# EAGLE design Goldilocks (EAGLE 6.3)
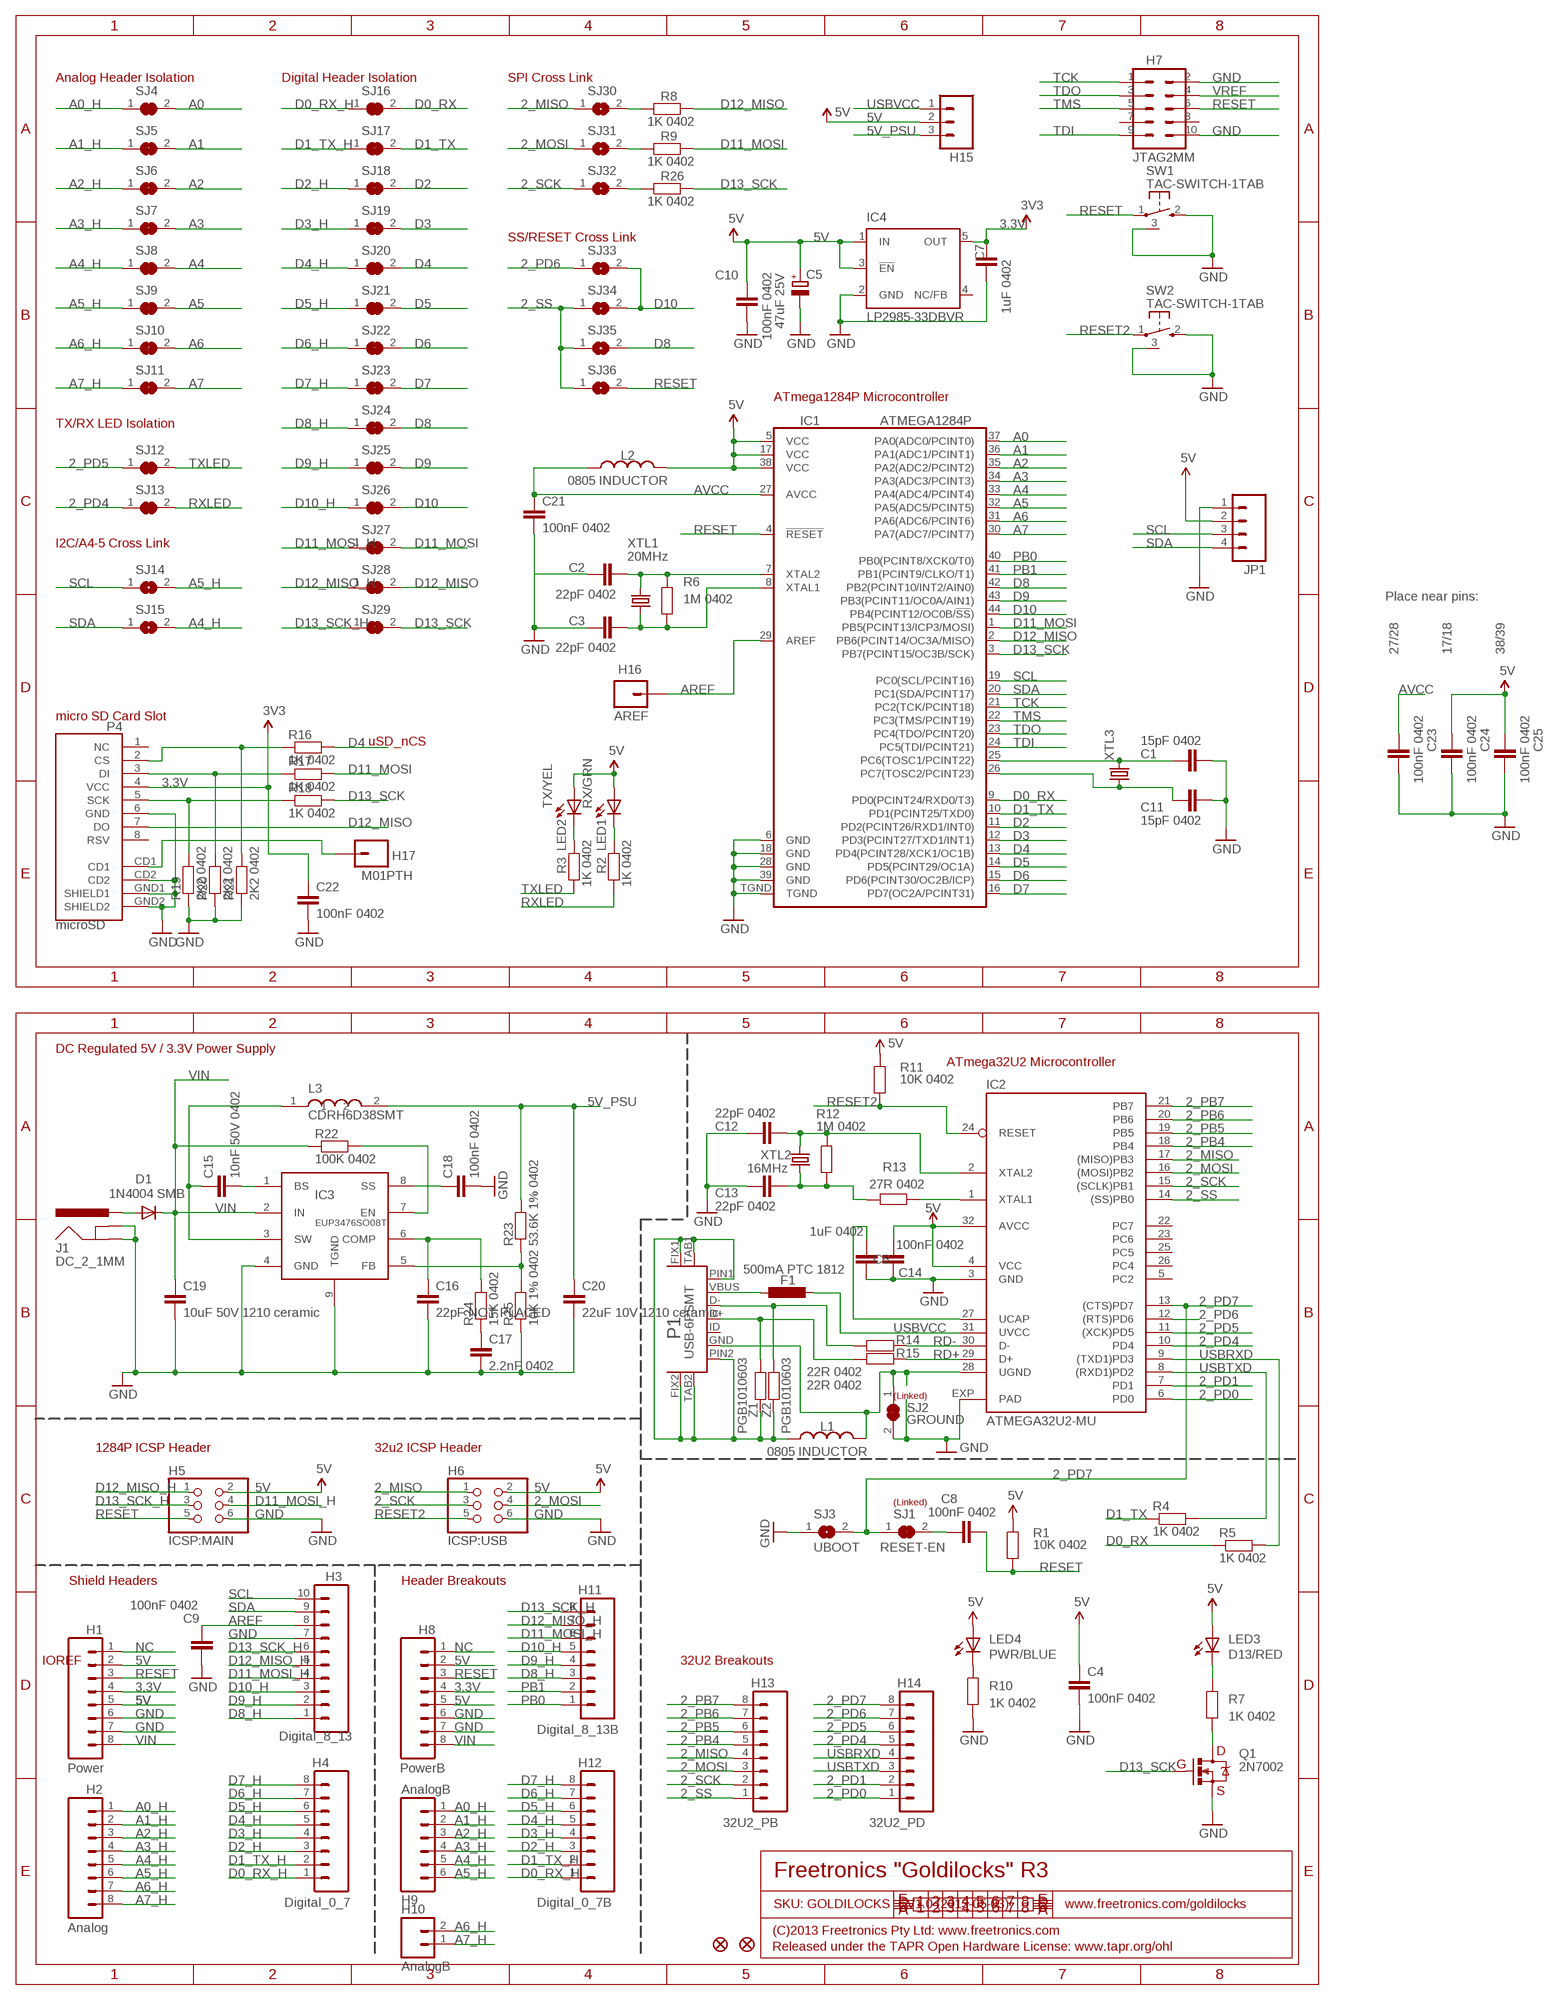
[diagram p0: schematic, sheet 1]

## Parts
C1  15pF 0402  C-EU0402C  [0402C]
C2  22pF 0402  C-EU0402C  [0402C]
C3  22pF 0402  C-EU0402C  [0402C]
C4  100nF 0402  C-EU0402C  [0402C]
C5  47uF 25V  CPOL-EUD  [PANASONIC_D]
C6  1uF 0402  C-EU0402C  [0402C]
C7  1uF 0402  C-EU0402C  [0402C]
C8  100nF 0402  C-EU0402C  [0402C]
C9  100nF 0402  C-EU0402C  [0402C]
C10  100nF 0402  C-EU0402C  [0402C]
C11  15pF 0402  C-EU0402C  [0402C]
C12  22pF 0402  C-EU0402C  [0402C]
C13  22pF 0402  C-EU0402C  [0402C]
C14  100nF 0402  C-EU0402C  [0402C]
C15  10nF 50V 0402  C-EU0402C  [0402C]
C16  22pF NOT PLACED  C-EU0402C  [0402C]
C17  2.2nF 0402  C-EU0402C  [0402C]
C18  100nF 0402  C-EU0402C  [0402C]
C19  10uF 50V 1210 ceramic  C-EUC1210  [C1210]
C20  22uF 10V 1210 ceramic  C-EUC1210  [C1210]
C21  100nF 0402  C-EU0402C  [0402C]
C22  100nF 0402  C-EU0402C  [0402C]
C23  100nF 0402  C-EU0402C  [0402C]
C24  100nF 0402  C-EU0402C  [0402C]
C25  100nF 0402  C-EU0402C  [0402C]
D1  1N4004 SMB  DIODESMB  [SMB-DIODE]
F1  500mA PTC 1812  L-EUL1812  [L1812]
H1  Power  M08  [1X08]
H2  Analog  M08  [1X08]
H3  Digital_8_13  M100.1  [1X10]
H4  Digital_0_7  M08  [1X08]
H5  ICSP:MAIN  PINHD-2X3  [2X03]
H6  ICSP:USB  PINHD-2X3  [2X03]
H7  JTAG2MM  [SAMTEC-TMM-DOUBLE]
H8  PowerB  M08  [1X08]
H9  AnalogB  M06SIP  [1X06]
H10  AnalogB  M02PTH  [1X02]
H11  Digital_8_13B  M08  [1X08]
H12  Digital_0_7B  M08  [1X08]
H13  32U2_PB  M08  [1X08]
H14  32U2_PD  M08  [1X08]
H15  M03PTH  [1X03]
H16  AREF  M01PTH  [1X01]
H17  M01PTH  [1X01]
IC1  ATMEGA1284P  [QFN-44M1]
IC2  ATMEGA32U2-MU  ATMEL_ATMEGA8U2-MUQFN  [ATMEL_QFN32]
IC3  EUP3476SO08T  [SO08T]
IC4  LP2985-33DBVR  TEXAS_TPS77033  [TEXAS_SOT23-DBV]
J1  DC_2_1MM  POWER_JACKPTH  [POWER_JACK_PTH]
JP1  M04PTH  [1X04]
L1  0805 INDUCTOR  INDUCTOR0805-LARGE  [0805-LARGE]
L2  0805 INDUCTOR  INDUCTOR0805-LARGE  [0805-LARGE]
L3  CDRH6D38SMT  [CDRH]
LED1  RX/GRN  LED0402  [LED-0402]
LED2  TX/YEL  LED0402  [LED-0402]
LED3  D13/RED  LED0402  [LED-0402]
LED4  PWR/BLUE  LED0402  [LED-0402]
P1  USB-6PSMT  [USB-MICROB-MB05PMXX]
P4  microSD  USD-SOCKETNEW  [MICRO-SD-SOCKET-PP]
Q1  2N7002  MOSFET-NCHANNELSMD  [SOT23-3]
R1  10K 0402  RESISTOR0402  [0402]
R2  1K 0402  RESISTOR0402  [0402]
R3  1K 0402  RESISTOR0402  [0402]
R4  1K 0402  RESISTOR0402  [0402]
R5  1K 0402  RESISTOR0402  [0402]
R6  1M 0402  RESISTOR0402  [0402]
R7  1K 0402  RESISTOR0402  [0402]
R8  1K 0402  RESISTOR0402  [0402]
R9  1K 0402  RESISTOR0402  [0402]
R10  1K 0402  RESISTOR0402  [0402]
R11  10K 0402  RESISTOR0402  [0402]
R12  1M 0402  RESISTOR0402  [0402]
R13  27R 0402  RESISTOR0402  [0402]
R14  22R 0402  RESISTOR0402  [0402]
R15  22R 0402  RESISTOR0402  [0402]
R16  1K 0402  RESISTOR0402  [0402]
R17  1K 0402  RESISTOR0402  [0402]
R18  1K 0402  RESISTOR0402  [0402]
R19  2K2 0402  RESISTOR0402  [0402]
R20  2K2 0402  RESISTOR0402  [0402]
R21  2K2 0402  RESISTOR0402  [0402]
R22  100K 0402  RESISTOR0402  [0402]
R23  53.6K 1% 0402  RESISTOR0402  [0402]
R24  15K 0402  RESISTOR0402  [0402]
R25  10K 1% 0402  RESISTOR0402  [0402]
R26  1K 0402  RESISTOR0402  [0402]
SJ1  RESET-EN  SJCN  [SJC]
SJ2  GROUND  SJCN  [SJC]
SJ3  UBOOT  SJ  [SJ]
SJ4  SJC0402  [0402SJC]
SJ5  SJC0402  [0402SJC]
SJ6  SJC0402  [0402SJC]
SJ7  SJC0402  [0402SJC]
SJ8  SJC0402  [0402SJC]
SJ9  SJC0402  [0402SJC]
SJ10  SJC0402  [0402SJC]
SJ11  SJC0402  [0402SJC]
SJ12  SJC0402  [0402SJC]
SJ13  SJC0402  [0402SJC]
SJ14  SJ  [SJ]
SJ15  SJ  [SJ]
SJ16  SJC0402  [0402SJC]
SJ17  SJC0402  [0402SJC]
SJ18  SJC0402  [0402SJC]
SJ19  SJC0402  [0402SJC]
SJ20  SJC0402  [0402SJC]
SJ21  SJC0402  [0402SJC]
SJ22  SJC0402  [0402SJC]
SJ23  SJC0402  [0402SJC]
SJ24  SJC0402  [0402SJC]
SJ25  SJC0402  [0402SJC]
SJ26  SJC0402  [0402SJC]
SJ27  SJC0402  [0402SJC]
SJ28  SJC0402  [0402SJC]
SJ29  SJC0402  [0402SJC]
SJ30  MISO  SJN  [SJ]
SJ31  MOSI  SJN  [SJ]
SJ32  SCK  SJN  [SJ]
SJ33  SJN  [SJ]
SJ34  SJN  [SJ]
SJ35  SJN  [SJ]
SJ36  SJN  [SJ]
SW1  TAC-SWITCH-1TAB  [TACT-VERT-1TAB]
SW2  TAC-SWITCH-1TAB  [TACT-VERT-1TAB]
U$5  FIDUCIAL1X2.5  [FIDUCIAL-1X2.5]
U$14  FIDUCIAL1X2.5  [FIDUCIAL-1X2.5]
XTL1  20MHz  CRYSTALHC49UV  [HC49U-V]
XTL2  16MHz  CRYSTALHC49UV  [HC49U-V]
XTL3  CRYSTALTC38H  [TC38H]
Z1  PGB1010603  RESISTOR0603  [0603]
Z2  PGB1010603  RESISTOR0603  [0603]

## Nets
2_MISO: H6.1 H13.4 IC2.17((MISO)PB3) SJ30.1
2_MOSI: H6.4 H13.3 IC2.16((MOSI)PB2) SJ31.1
2_PB4: H13.5 IC2.18(PB4)
2_PB5: H13.6 IC2.19(PB5)
2_PB6: H13.7 IC2.20(PB6)
2_PB7: H13.8 IC2.21(PB7)
2_PD0: H14.1 IC2.6(PD0)
2_PD1: H14.2 IC2.7(PD1)
2_PD4: H14.5 IC2.10(PD4) SJ13.1
2_PD5: H14.6 IC2.11((XCK)PD5) SJ12.1
2_PD6: H14.7 IC2.12((RTS)PD6) SJ33.1
2_PD7: H14.8 IC2.13((CTS)PD7) SJ1.1 SJ3.2
2_SCK: H6.3 H13.2 IC2.15((SCLK)PB1) SJ32.1
2_SS: H13.1 IC2.14((SS)PB0) SJ34.1 SJ35.1 SJ36.1
3.3V: C7.2 C22.1 H1.4 H8.4 IC4.5(OUT) P4.4(VCC) ; supply symbol labelled 3V3
5V: C4.1 C5.+ C10.1 C14.1 C24.1 C25.1 H1.2 H1.5 H5.2 H6.2 H8.2 H8.5 H15.2 IC1.5(VCC) IC1.17(VCC) IC1.38(VCC) IC2.4(VCC) IC2.32(AVCC) IC4.1(IN) IC4.3(!EN) JP1.2 L2.2 LED1.A LED2.A LED3.A LED4.A R1.2 R11.2
5V_PSU: C20.1 H15.3 L3.2 R23.2
A0: IC1.37(PA0(ADC0/PCINT0)) SJ4.2
A0_H: H2.1 H9.1 SJ4.1
A1: IC1.36(PA1(ADC1/PCINT1)) SJ5.2
A1_H: H2.2 H9.2 SJ5.1
A2: IC1.35(PA2(ADC2/PCINT2)) SJ6.2
A2_H: H2.3 H9.3 SJ6.1
A3: IC1.34(PA3(ADC3/PCINT3)) SJ7.2
A3_H: H2.4 H9.4 SJ7.1
A4: IC1.33(PA4(ADC4/PCINT4)) SJ8.2
A4_H: H2.5 H9.5 SJ8.1 SJ15.2
A5: IC1.32(PA5(ADC5/PCINT5)) SJ9.2
A5_H: H2.6 H9.6 SJ9.1 SJ14.2
A6: IC1.31(PA6(ADC6/PCINT6)) SJ10.2
A6_H: H2.7 H10.2 SJ10.1
A7: IC1.30(PA7(ADC7/PCINT7)) SJ11.2
A7_H: H2.8 H10.1 SJ11.1
AREF: C9.1 H3.8 H16.1 IC1.29(AREF)
AVCC: C21.1 C23.1 IC1.27(AVCC) L2.1
D0_RX: IC1.9(PD0(PCINT24/RXD0/T3)) R5.1 SJ16.2
D0_RX_H: H4.1 H12.1 SJ16.1
D1_TX: IC1.10(PD1(PCINT25/TXD0)) R4.1 SJ17.2
D1_TX_H: H4.2 H12.2 SJ17.1
D2: IC1.11(PD2(PCINT26/RXD1/INT0)) SJ18.2
D2_H: H4.3 H12.3 SJ18.1
D3: IC1.12(PD3(PCINT27/TXD1/INT1)) SJ19.2
D3_H: H4.4 H12.4 SJ19.1
D4: IC1.13(PD4(PCINT28/XCK1/OC1B)) R16.2 SJ20.2
D4_H: H4.5 H12.5 SJ20.1
D5: IC1.14(PD5(PCINT29/OC1A)) SJ21.2
D5_H: H4.6 H12.6 SJ21.1
D6: IC1.15(PD6(PCINT30/OC2B/ICP)) SJ22.2
D6_H: H4.7 H12.7 SJ22.1
D7: IC1.16(PD7(OC2A/PCINT31)) SJ23.2
D7_H: H4.8 H12.8 SJ23.1
D8: IC1.42(PB2(PCINT10/INT2/AIN0)) SJ24.2 SJ35.2
D8_H: H3.1 H11.3 SJ24.1
D9: IC1.43(PB3(PCINT11/OC0A/AIN1)) SJ25.2
D9_H: H3.2 H11.4 SJ25.1
D10: IC1.44(PB4(PCINT12/OC0B/!SS!)) SJ26.2 SJ33.2 SJ34.2
D10_H: H3.3 H11.5 SJ26.1
D11_MOSI: H5.4 IC1.1(PB5(PCINT13/ICP3/MOSI)) R9.2 R17.2 SJ27.2
D11_MOSI_H: H3.4 H11.6 SJ27.1
D12_MISO: H5.1 IC1.2(PB6(PCINT14/OC3A/MISO)) P4.7(DO) R8.2 SJ28.2
D12_MISO_H: H3.5 H11.7 SJ28.1
D13_SCK: H5.3 IC1.3(PB7(PCINT15/OC3B/SCK)) Q1.1(G) R18.2 R26.2 SJ29.2
D13_SCK_H: H3.6 H11.8 SJ29.1
GND: C1.2 C2.1 C3.1 C4.2 C5.- C6.2 C7.1 C9.2 C10.2 C11.2 C12.1 C13.1 C14.2 C16.2 C17.2 C18.2 C19.2 C20.2 C21.2 C22.2 C23.2 C24.2 C25.2 H1.6 H1.7 H3.7 H5.6 H6.6 H7.2 H7.10 H8.6 H8.7 IC1.6(GND) IC1.18(GND) IC1.28(GND) IC1.39(GND) IC1.TGND IC2.3(GND) IC2.EXP(PAD) IC3.4(GND) IC3.9(TGND) IC4.2(GND) J1.GND J1.GNDBREAK JP1.1 P4.6(GND) P4.CD2 P4.GND1(SHIELD1) P4.GND2(SHIELD2) Q1.2(S) R10.1 R19.1 R20.1 R21.1 R25.1 SJ2.2 SJ3.1 SW1.2 SW1.3 SW2.2 SW2.3
N$1: C8.1 SJ1.2
N$2: IC2.1(XTAL1) R13.1
N$3: L1.1 P1.FIX1 P1.FIX2 P1.PIN1 P1.PIN2 P1.TAB1 P1.TAB2 Z1.2 Z2.2
N$4: LED3.C R7.2
N$5: C2.2 IC1.7(XTAL2) R6.2 XTL1.2
N$6: Q1.3(D) R7.1
N$7: C3.2 IC1.8(XTAL1) R6.1 XTL1.1
N$8: D1.A J1.PWR
N$9: R8.1 SJ30.2
N$11: LED1.C R2.2
N$13: LED2.C R3.2
N$14: LED4.C R10.2
N$16: P1.D+ R15.2 Z1.1
N$17: P1.D- R14.2 Z2.1
N$19: C1.1 IC1.25(PC6(TOSC1/PCINT22)) XTL3.2
N$22: C11.1 IC1.26(PC7(TOSC2/PCINT23)) XTL3.1
N$23: C15.2 IC3.1(BS)
N$24: R9.1 SJ31.2
N$25: C15.1 IC3.3(SW) L3.1
N$28: C17.1 R24.1
N$31: IC3.5(FB) R23.1 R25.2
N$34: C18.1 IC3.8(SS)
N$36: R26.1 SJ32.2
N$37: IC3.7(EN) R22.2
N$43: C16.1 IC3.6(COMP) R24.2
N$113: C12.2 IC2.2(XTAL2) R12.2 XTL2.2
N$114: C13.2 R12.1 R13.2 XTL2.1
N$115: F1.1 P1.VBUS
N$117: C6.1 IC2.27(UCAP)
N$118: P4.2(CS) R16.1 R21.2
N$119: P4.3(DI) R17.1 R20.2
N$120: P4.5(SCK) R18.1 R19.2
N$121: H17.1 P4.CD1
NC: H1.1 H8.1
PB0: H11.1 IC1.40(PB0(PCINT8/XCK0/T0))
PB1: H11.2 IC1.41(PB1(PCINT9/CLKO/T1))
RD+: IC2.29(D+) R15.1
RD-: IC2.30(D-) R14.1
RESET: C8.2 H1.3 H5.5 H7.6 H8.3 IC1.4(!RESET) R1.1 SJ36.2 SW1.1
RESET2: H6.5 IC2.24(RESET) R11.1 SW2.1
RXLED: R2.1 SJ13.2
SCL: H3.10 IC1.19(PC0(SCL/PCINT16)) JP1.3 SJ14.1
SDA: H3.9 IC1.20(PC1(SDA/PCINT17)) JP1.4 SJ15.1
TCK: H7.1 IC1.21(PC2(TCK/PCINT18))
TDI: H7.9 IC1.24(PC5(TDI/PCINT21))
TDO: H7.3 IC1.23(PC4(TDO/PCINT20))
TMS: H7.5 IC1.22(PC3(TMS/PCINT19))
TXLED: R3.1 SJ12.2
UGND: IC2.28(UGND) L1.2 P1.GND SJ2.1
USBRXD: H14.4 IC2.9((TXD1)PD3) R5.2
USBTXD: H14.3 IC2.8((RXD1)PD2) R4.2
USBVCC: F1.2 H15.1 IC2.31(UVCC)
VIN: C19.1 D1.C H1.8 H8.8 IC3.2(IN) R22.1
VREF: H7.4
Unconnected: H7.7 H7.8 IC2.5(PC2) IC2.22(PC7) IC2.23(PC6) IC2.25(PC5) IC2.26(PC4) IC4.4(NC/FB) P1.ID P4.1(NC) P4.8(RSV)

## Notes on the sheet
- Analog Header Isolation | Digital Header Isolation | SPI Cross Link
- SS/RESET Cross Link
- ATmega1284P Microcontroller
- TX/RX LED Isolation
- I2C/A4-5 Cross Link
- Place near pins:
- 27/28 | 17/18 | 38/39
- micro SD Card Slot
- uSD_nCS
- DC Regulated 5V / 3.3V Power Supply
- ATmega32U2 Microcontroller
- (Linked)
- 1284P ICSP Header | 32u2 ICSP Header
- (Linked)
- Shield Headers | Header Breakouts
- IOREF | 32U2 Breakouts
- D
- G
- S
- Freetronics "Goldilocks" R3
- SKU: GOLDILOCKS | V1.0 (2013-05-03) | www.freetronics.com/goldilocks
- (C)2013 Freetronics Pty Ltd: www.freetronics.com
- Released under the TAPR Open Hardware License: www.tapr.org/ohl

## Library data of the parts
C1-C4 C6-C25 = freetronics-jon:C-EU: CAPACITOR, European symbol
C5 = rcl:CPOL-EU: POLARIZED CAPACITOR, European symbol
D1 = freetronics-jon:DIODE: Diode These are standard reverse protection diodes and small signal diodes. SMA package can handle up to about 1A. SOD-323 can handle about 200mA. What the SOD-323 package when ordering, there are some mfgs out there that are 5-pin packages.
F1 = rcl:L-EU: INDUCTOR, European symbol
H1 H2 H4 H8 H11-H14 = freetronics:M08: Header 8 Standard 8-pin 0.1" header. Use with straight break away headers (SKU : PRT-00116), right angle break away headers (PRT-00553), swiss pins (PRT-00743), machine pins (PRT-00117), and female headers (PRT-00115).
H3 = freetronics-original:M10: Header 10 Standard 10-pin 0.1" header. Use with straight break away headers (SKU : PRT-00116), right angle break away headers (PRT-00553), swiss pins (PRT-00743), machine pins (PRT-00117), and female headers (PRT-00115).
H5 H6 = pinhead:PINHD-2X3: PIN HEADER
H7 = freetronics-jon:JTAG
H9 = freetronics:M06: Header 6 Standard 6-pin 0.1" header. Use with straight break away headers (SKU : PRT-00116), right angle break away headers (PRT-00553), swiss pins (PRT-00743), machine pins (PRT-00117), and female headers (PRT-00115). Molex polarized connector foot print use with SKU : PRT-08094 with associated crimp pins and housings. NOTES ON THE VARIANTS LOCK and LOCK_LONGPADS... This footprint was designed to help hold the alignment of a through-hole component (i.e. 6-pin header) while soldering it into place. You may notice that each hole has been shifted either up or down by 0.005 of an inch from it's more standard position (which is a perfectly straight line). This slight alteration caused the pins (the squares in the middle) to touch the edges of the holes. Because they are alternating, it causes a "brace" to hold the component in place. 0.005 has proven to be the perfect amount of "off-center" position when using our standard breakaway headers. Although looks a little odd when you look at the bare footprint, once you have a header in there, the alteration is very hard to notice. Also, if you push a header all the way into place, it is covered up entirely on the bottom side. This idea of altering the position of holes to aid alignment will be further integrated into the Sparkfun Library for other footprints. It can help hold any component with 3 or more connection pins.
H10 = freetronics-master-v1.1:M02: Header 2 Standard 2-pin 0.1" header. Use with straight break away headers (SKU : PRT-00116), right angle break away headers (PRT-00553), swiss pins (PRT-00743), machine pins (PRT-00117), and female headers (PRT-00115). Molex polarized connector foot print use with SKU : PRT-08233 with associated crimp pins and housings.
H15 = freetronics-master-v1.1:M03: Header 3 Standard 3-pin 0.1" header. Use with straight break away headers (SKU : PRT-00116), right angle break away headers (PRT-00553), swiss pins (PRT-00743), machine pins (PRT-00117), and female headers (PRT-00115). Molex polarized connector foot print use with SKU : PRT-08232 with associated crimp pins and housings.
H16 H17 = freetronics-2:M01: Header 1 Standard 1-pin 0.1" header. Use with straight break away headers (SKU : PRT-00116), right angle break away headers (PRT-00553), swiss pins (PRT-00743), machine pins (PRT-00117), and female headers (PRT-00115).
IC1 = freetronics-jon:ATMEGA1284P
IC2 = freetronics-jon:ATMEL_ATMEGA8U2-MU
IC3 = freetronics-jon:EUP3476
IC4 = freetronics-jon:TEXAS_TPS770*: ULTRALOW-POWER 50-mA LOW-DROPOUT LINEAR REGULATORS 50-mA Low-Dropout Regulator Source: http://focus.ti.com/lit/ds/symlink/tps77001.pdf
J1 = freetronics:POWER_JACK: Power Jack This is the standard 5.5mm barrel jack for power. The PTH is the most common, proven, reliable, footprint. All others are experimental. The Slot footprint only works if the mill layer is transmitted to the PCB fab house so be warned. Spark Fun Electronics SKU : PRT-00119. Mating wall wart : TOL-00298 (and others)
JP1 = freetronics-master-v1.1:M04: Header 4 Standard 4-pin 0.1" header. Use with straight break away headers (SKU : PRT-00116), right angle break away headers (PRT-00553), swiss pins (PRT-00743), machine pins (PRT-00117), and female headers (PRT-00115). Molex polarized connector foot print use with SKU : PRT-08231 with associated crimp pins and housings.
L1 L2 = freetronics-master-v1:INDUCTOR: Inductors Basic Inductor/Choke - 0603 and 1206. Footprints are not proven and vary greatly between part numbers.
L3 = freetronics-jon:CDRH6D38: Inductor
LED1-LED4 = freetronics-jon:LED: LEDs Standard schematic elements and footprints for 5mm, 3mm, 1206, and 0603 sized LEDs. 5mm - Spark Fun Electronics SKU : COM-00529 (and others)
P1 = freetronics-jon:USB-6P
P4 = freetronics-master-v1:USD-SOCKET: microSD Socket Push-push type uSD socket. Schematic element and footprint production proven. Spark Fun Electronics SKU : PRT-00127. tDoc lines correctly indicate media card edge positions when inserting (unlocked, locked, depressed).
Q1 = freetronics:MOSFET-NCHANNEL
R1-R26 = freetronics-jon:RESISTOR: Resistor Basic schematic elements and footprints for 0603, 1206, and PTH 1/10th watt (small) resistors.
SJ1 SJ2 SJ4-SJ13 SJ16-SJ29 = freetronics-jon:SJC
SJ3 = jumper:SJ: SMD solder JUMPER
SJ14 SJ15 = freetronics-master-v1.1:SJ: SMD solder JUMPER
SJ30-SJ36 = freetronics-jon:SJ: SMD solder JUMPER
SW1 SW2 = freetronics-jon:TAC-SWITCH-1TAB
U$5 U$14 = freetronics:FIDUCIAL: Fiducial Alignment Points Various fiducial points for machine vision alignment.
XTL1 XTL2 = freetronics-jon:CRYSTAL: Crystals Various standard crystals. Proven footprints. Spark Fun Electronics SKU : COM-00534
XTL3 = freetronics-original:CRYSTAL: Crystals Various standard crystals. Proven footprints. Spark Fun Electronics SKU : COM-00534
Z1 Z2 = freetronics:RESISTOR: Resistor Basic schematic elements and footprints for 0603, 1206, and PTH 1/10th watt (small) resistors.

## Board
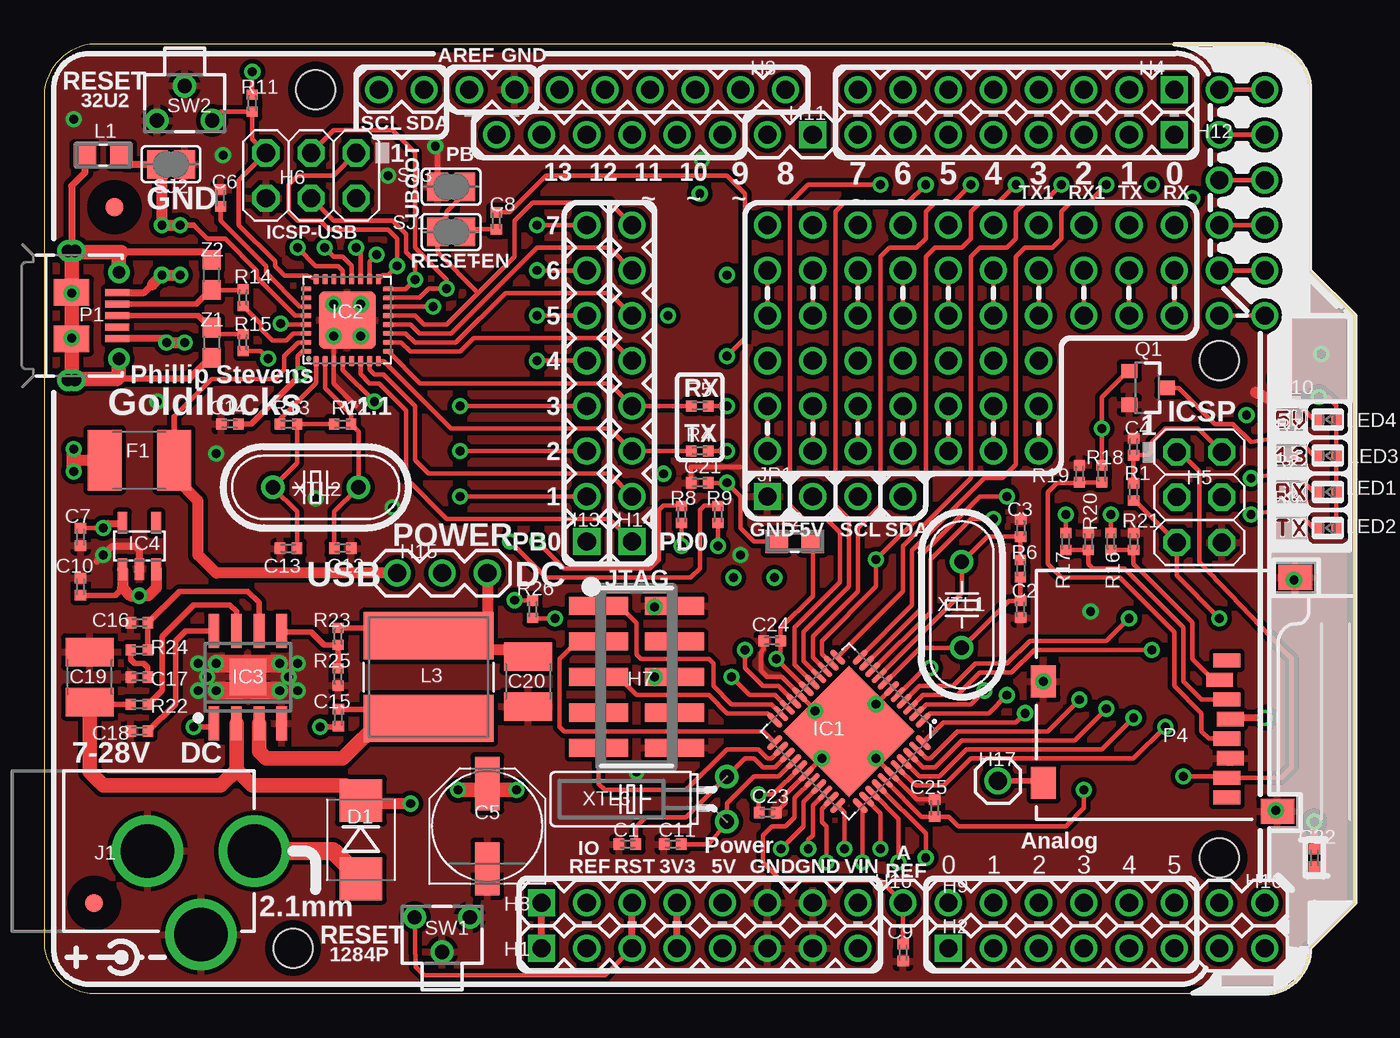
[diagram p1: board, top side]
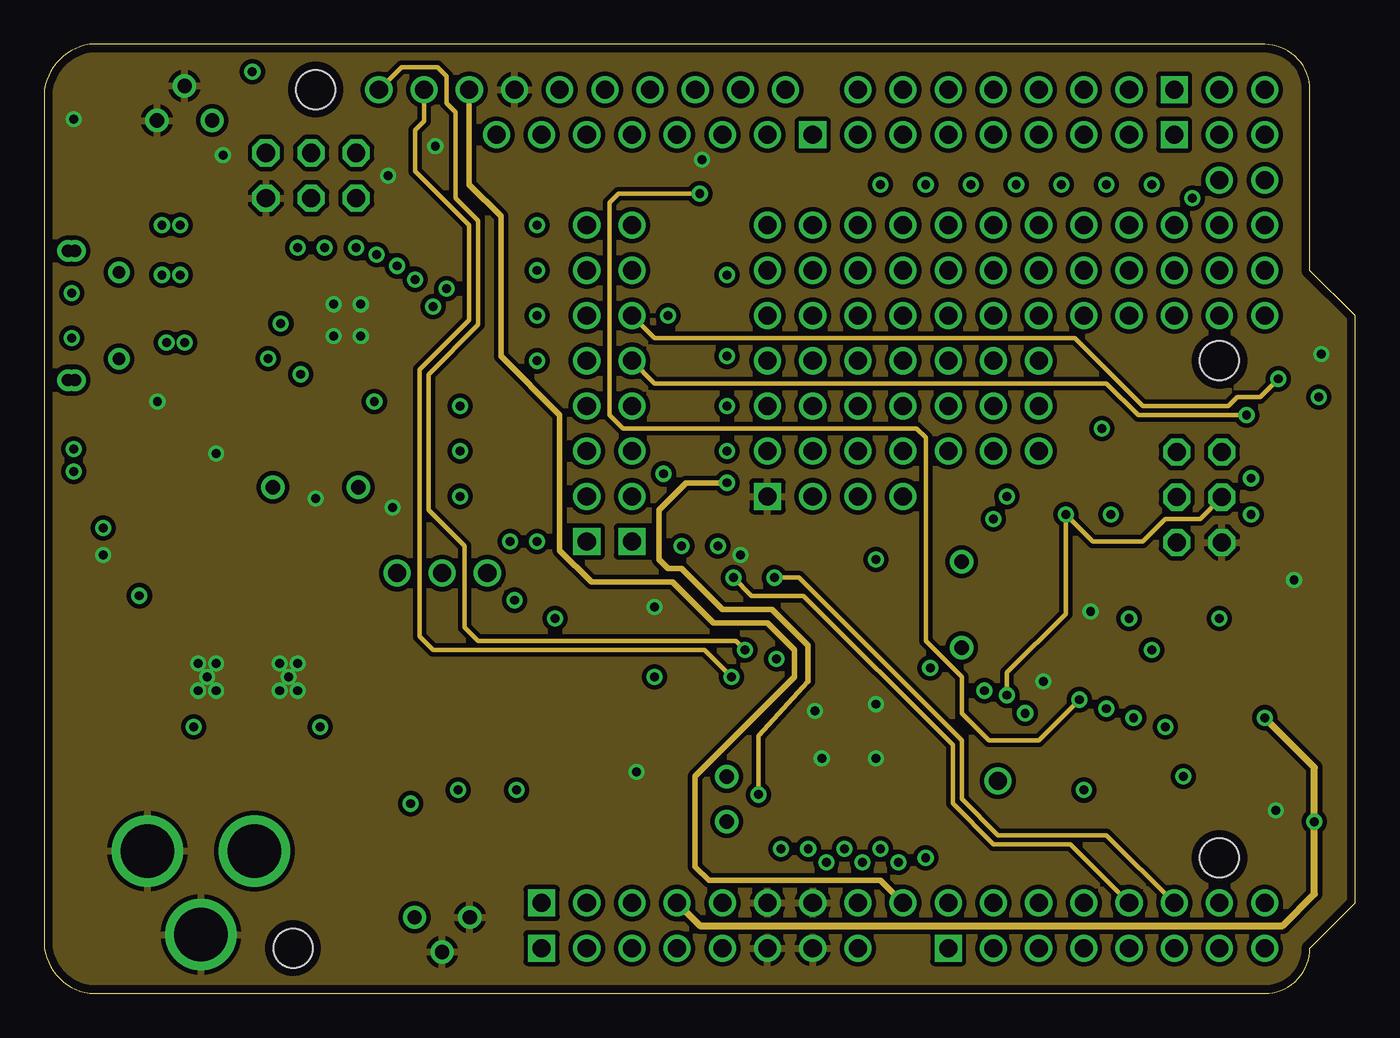
[diagram p2: board, inner layer Route2]
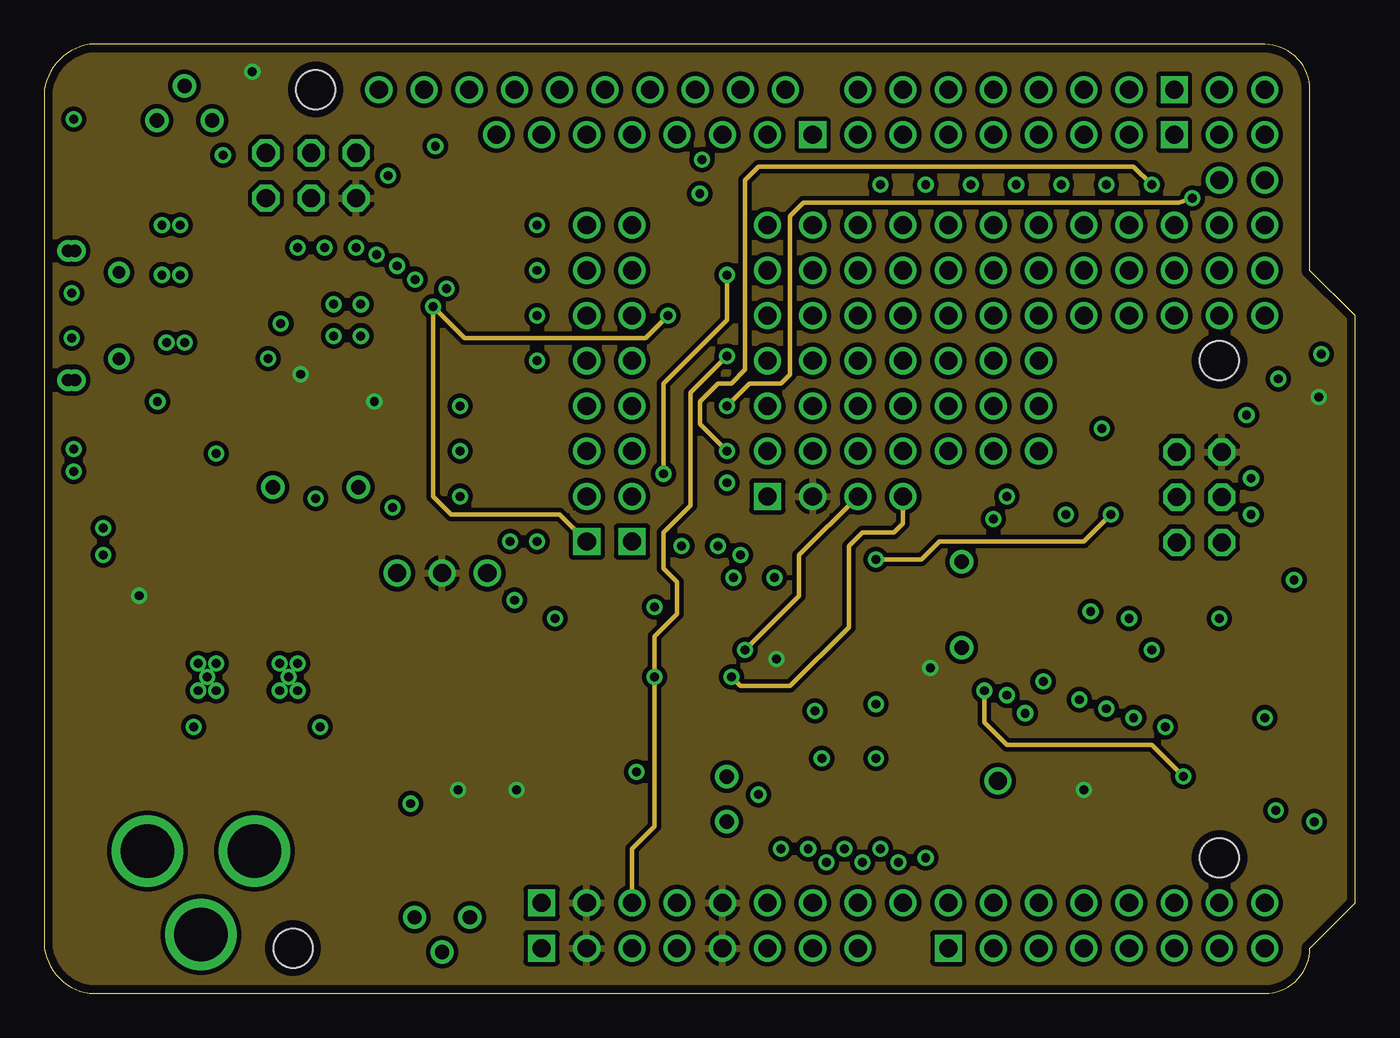
[diagram p3: board, inner layer Route15]
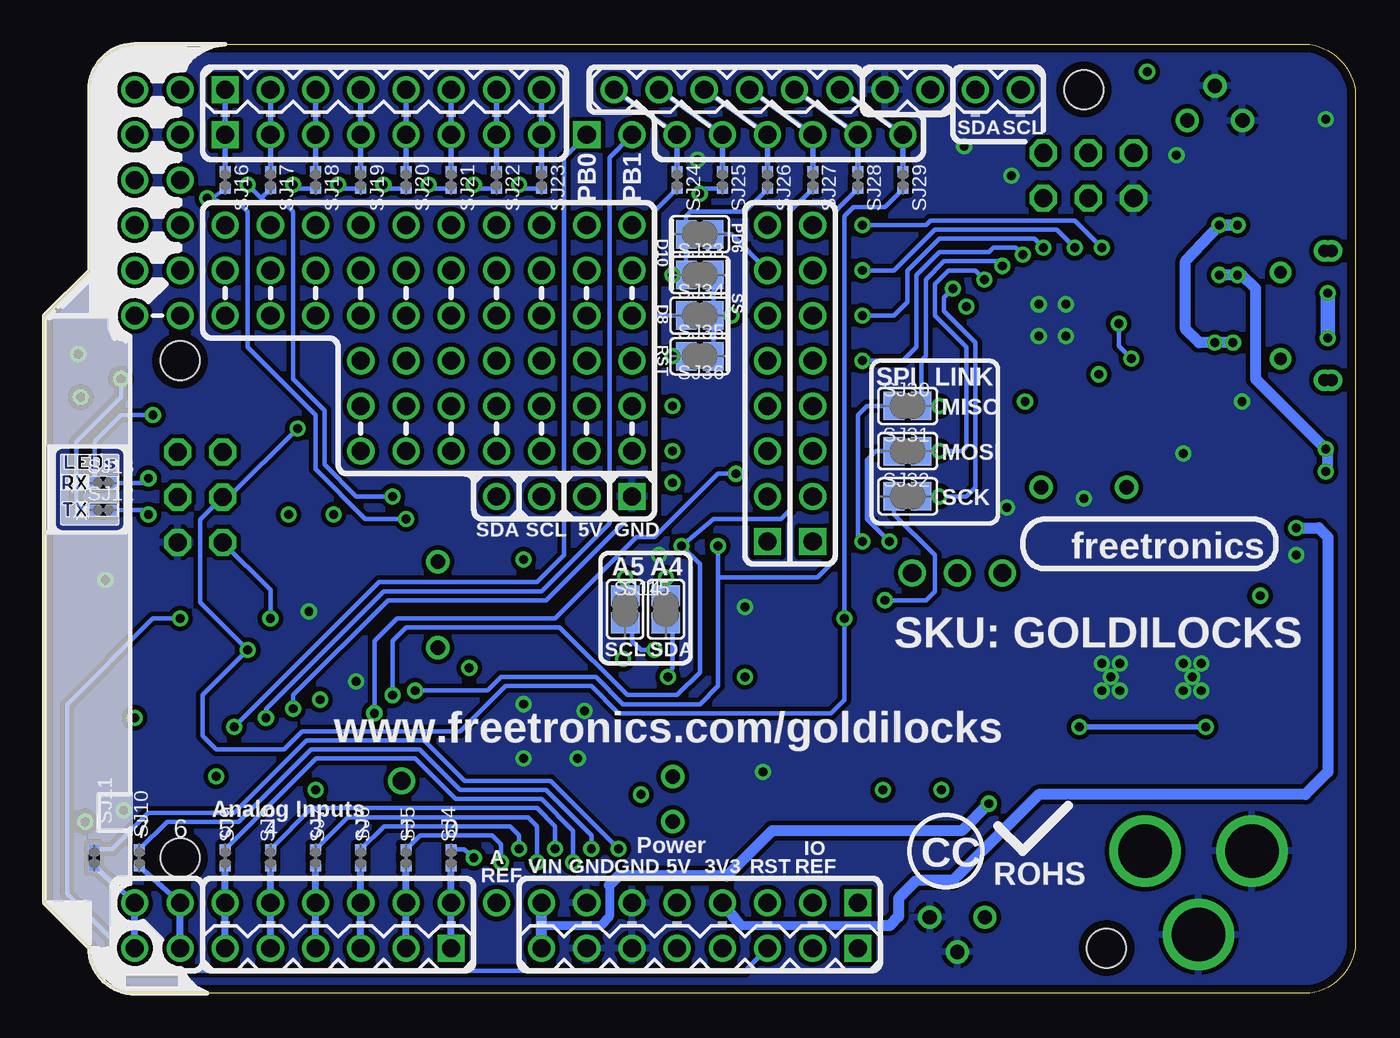
[diagram p4: board, bottom side, seen from below]

Size 73.66 x 53.34 mm. Coordinates in mm from the lower left corner, seen from the top.
Outline: 0,2.54 arc74 2.54,0 68.58,0 arc90 71.12,2.54 73.66,5.08 73.66,38.1 71.12,40.64 71.12,50.8 arc90 68.58,53.34 2.54,53.34 arc74 0,50.8 0,2.54
Copper layers (1+2*15+16): Top 0.035mm / dielectric 1.5mm / Route2 0.035mm / dielectric 0.15mm / Route15 0.035mm / dielectric 0.2mm / Bottom 0.035mm
Design rules "default *": minimum track width 10mil, minimum drill 18mil, track to track 10mil, track to pad 10mil, pad to pad 10mil, via to via 10mil, smd to smd 8mil, copper to edge 18mil, drill to drill 8mil, minimum pad ring 10mil, minimum via ring 8mil, stop-mask expansion 4mil, vias tented up to drill 25mil, thermal gap 10mil
Holes 2.2 mm at 66.04,35.56 66.04,7.62 15.24,50.8 13.97,2.54
tRestrict: area 2.9,43.2 to 5,45.2; area 1.8,4.1 to 3.8,6.1

### Footprints (pad centres in the part's own frame; a part is rotated, then mirrored left to right if it is on the bottom)
0402C = smd 0.59 x 0.64: 1 -0.48,0; 2 0.48,0
PANASONIC_D = smd 3 x 1.4: + 2.4,0; - -2.4,0
C1210 = smd 1.6 x 2.7: 1 -1.4,0; 2 1.4,0
SMB-DIODE = smd 2.4 x 2.4: A 2.2,0; C -2.2,0
L1812 = smd 1.9 x 3.4: 1 -1.95,0; 2 1.95,0
1X08 = drill 1.016 square: 1 0,0 | drill 1.016: 2 2.54,0; 3 5.08,0; 4 7.62,0; 5 10.16,0; 6 12.7,0; 7 15.24,0; 8 17.78,0
1X10 = drill 1.016: 1 0,0; 2 2.54,0; 3 5.08,0; 4 7.62,0; 5 10.16,0; 6 12.7,0; 7 15.24,0; 8 17.78,0; 9 20.32,0; 10 22.86,0
2X03 = drill 1.016 octagon: 1 -2.54,-1.27; 2 -2.54,1.27; 3 0,-1.27; 4 0,1.27; 5 2.54,-1.27; 6 2.54,1.27
SAMTEC-TMM-DOUBLE = smd 3.302 x 1.016: 1 -2.134,3.988; 2 2.134,3.988; 3 -2.134,2; 4 2.134,2; 5 -2.134,0; 6 2.134,0; 7 -2.134,-2; 8 2.134,-2; 9 -2.134,-3.988; 10 2.134,-3.988
1X06 = drill 1.016: 1 0,0; 2 2.54,0; 3 5.08,0; 4 7.62,0; 5 10.16,0; 6 12.7,0
1X02 = drill 1.016: 1 0,0; 2 2.54,0
1X03 = drill 1.016: 1 0,0; 2 2.54,0; 3 5.08,0
1X01 = drill 1.016: 1 0,0
QFN-44M1 = smd 0.3 x 1.05: 1 -2.5,-3.4; 2 -2,-3.4; 3 -1.5,-3.4; 4 -1,-3.4; 5 -0.5,-3.4; 6 0,-3.4; 7 0.5,-3.4; 8 1,-3.4; 9 1.5,-3.4; 10 2,-3.4; 11 2.5,-3.4; 23 2.5,3.4; 24 2,3.4; 25 1.5,3.4; 26 1,3.4; 27 0.5,3.4; 28 0,3.4; 29 -0.5,3.4; 30 -1,3.4; 31 -1.5,3.4; 32 -2,3.4; 33 -2.5,3.4 | smd 1.05 x 0.3: 12 3.4,-2.5; 13 3.4,-2; 14 3.4,-1.5; 15 3.4,-1; 16 3.4,-0.5; 17 3.4,0; 18 3.4,0.5; 19 3.4,1; 20 3.4,1.5; 21 3.4,2; 22 3.4,2.5; 34 -3.4,2.5; 35 -3.4,2; 36 -3.4,1.5; 37 -3.4,1; 38 -3.4,0.5; 39 -3.4,0; 40 -3.4,-0.5; 41 -3.4,-1; 42 -3.4,-1.5; 43 -3.4,-2; 44 -3.4,-2.5 | smd 5.2 x 5.2: TGND 0,0
ATMEL_QFN32 = smd 0.6 x 0.3: 1 -2.3,1.75; 2 -2.3,1.25; 3 -2.3,0.75; 4 -2.3,0.25; 5 -2.3,-0.25; 6 -2.3,-0.75; 7 -2.3,-1.25; 8 -2.3,-1.75; 17 2.3,-1.75; 18 2.3,-1.25; 19 2.3,-0.75; 20 2.3,-0.25; 21 2.3,0.25; 22 2.3,0.75; 23 2.3,1.25; 24 2.3,1.75 | smd 0.3 x 0.6: 9 -1.75,-2.3; 10 -1.25,-2.3; 11 -0.75,-2.3; 12 -0.25,-2.3; 13 0.25,-2.3; 14 0.75,-2.3; 15 1.25,-2.3; 16 1.75,-2.3; 25 1.75,2.3; 26 1.25,2.3; 27 0.75,2.3; 28 0.25,2.3; 29 -0.25,2.3; 30 -0.75,2.3; 31 -1.25,2.3; 32 -1.75,2.3 | smd 3.2 x 3.2: EXP 0,0
SO08T = smd 1.905 x 0.6: 1 -2.6,1.905; 2 -2.6,0.635; 3 -2.6,-0.635; 4 -2.6,-1.905; 5 2.6,-1.905; 6 2.6,-0.635; 7 2.6,0.635; 8 2.6,1.905 | smd 2.057 x 2.057: 9 0,0
TEXAS_SOT23-DBV = smd 0.55 x 1.2: 1 -0.95,-1.3; 2 0,-1.3; 3 0.95,-1.3; 4 0.95,1.3; 5 -0.95,1.3
POWER_JACK_PTH = drill 2.997: GND 0,7.7; GNDBREAK 4.7,10.7; PWR 0,13.7
1X04 = drill 1.016 square: 1 0,0 | drill 1.016: 2 2.54,0; 3 5.08,0; 4 7.62,0
0805-LARGE = smd 1.27 x 1.27: 1 -1.016,0; 2 1.016,0
CDRH = smd 7.3 x 2.65: 1 0,2.325; 2 0,-2.325
LED-0402 = smd 0.571 x 0.62: A -0.48,0; C 0.48,0
USB-MICROB-MB05PMXX = smd 0.4 x 1.35: D+ 0,2.575; D- -0.65,2.575; GND 1.3,2.575; ID 0.65,2.575; VBUS -1.3,2.575 | smd 1.5 x 2: FIX1 -1.3,0; FIX2 1.3,0 | drill 0.7: PIN1 -2.425,2.65; PIN2 2.425,2.65; SLOT1 -3.625,-0.2; SLOT2 3.625,-0.2; TAB1 -3.625,0.2; TAB2 3.625,0.2
MICRO-SD-SOCKET-PP = smd 0.8 x 1.5: 1 -8.94,10.7; 2 -7.84,10.3; 3 -6.74,10.7; 4 -5.64,10.9; 5 -4.54,10.7; 6 -3.44,10.9; 7 -2.34,10.7; 8 -1.24,10.7 | smd 1.8 x 1.4: CD1 -2.05,0.4; CD2 -7.75,0.4 | smd 1.4 x 1.9: GND1 -0.45,13.55; GND2 -13.6,14.55
SOT23-3 = smd 0.8 x 0.9: 1 -0.95,-1; 2 0.95,-1; 3 0,1.1
0402 = smd 0.571 x 0.62: 1 -0.48,0; 2 0.48,0
SJC = smd 1.168 x 1.6: 1 -0.762,0; 2 0.762,0
SJ = smd 1.168 x 1.6: 1 -0.762,0; 2 0.762,0
0402SJC = smd 0.571 x 0.62: 1 -0.48,0; 2 0.48,0
TACT-VERT-1TAB = drill 0.8: 1 -1.55,0.975; 2 1.55,0.975; 3 0,-0.975
FIDUCIAL-1X2.5 = smd 1 x 1: 1 0,0
HC49U-V = drill 0.813: 1 -2.413,0; 2 2.413,0
TC38H = drill 0.813: 1 -1.27,0; 2 1.27,0
0603 = smd 1.1 x 1: 1 -0.85,0; 2 0.85,0

### Placement (x,y rotation side)
C1  32.77,8.38 180 top
C2  54.86,21.59 90 top
C3  54.86,26.16 270 top
C4  61.21,30.73 90 top
C5  24.89,9.4 90 top
C6  9.91,44.7 90 top
C7  2.03,25.65 90 top
C8  25.4,43.43 90 top
C9  48.26,2.29 270 top
C10  2.03,22.86 90 top
C11  35.31,8.38 180 top
C12  16.76,25.02 180 top
C13  13.72,25.02 0 top
C14  10.41,32 180 top
C15  16.51,15.49 270 top
C16  5.33,20.83 180 top
C17  5.33,17.78 180 top
C18  5.33,14.73 180 top
C19  2.54,17.78 90 top
C20  27.18,17.53 270 top
C21  36.83,28.7 180 top
C22  71.37,7.62 270 top
C23  40.64,10.16 0 top
C24  40.89,19.81 180 top
C25  50.04,10.41 90 top
D1  17.78,8.64 270 top
F1  5.33,29.97 0 top
H1  27.94,2.54 0 top
H2  50.8,2.54 0 top
H3  41.66,50.8 180 top
H4  63.5,50.8 180 top
H5  64.91,27.89 270 top
H6  14.99,45.97 180 top
H7  33.27,17.78 0 top
H8  27.94,5.08 0 top
H9  50.8,5.08 0 top
H10  68.58,5.08 180 top
H11  43.18,48.26 180 top
H12  63.5,48.26 180 top
H13  30.48,25.4 90 top
H14  33.02,25.4 90 top
H15  19.81,23.62 0 top
H16  48.26,5.08 0 top
H17  53.59,11.94 0 top
IC1  45.21,14.73 135 top
IC2  17.02,37.85 90 top
IC3  11.43,17.78 90 top
IC4  5.33,25.15 0 top
J1  -1.91,8 270 top
JP1  40.64,27.94 0 top
L1  3.3,47.12 0 top
L2  42.16,25.4 0 top
L3  21.59,17.78 180 top
LED1  72.14,28.19 180 top
LED2  72.14,26.16 180 top
LED3  72.14,30.23 180 top
LED4  72.14,32.26 180 top
P1  1.52,38.1 270 top
P4  55.75,9.78 270 top
Q1  61.98,34.04 270 top
R1  61.21,28.19 90 top
R2  69.85,29.21 0 top
R3  69.85,27.18 0 top
R4  36.83,30.48 180 top
R5  36.83,33.02 180 top
R6  54.86,23.88 270 top
R7  69.85,31.24 0 top
R8  35.81,26.92 270 top
R9  37.85,26.92 270 top
R10  69.85,33.27 0 top
R11  11.68,50.04 90 top
R12  16.76,32 0 top
R13  13.72,32 0 top
R14  11.18,39.12 90 top
R15  11.18,36.58 90 top
R16  59.94,25.4 90 top
R17  57.4,25.4 90 top
R18  59.44,29.21 90 top
R19  58.17,29.21 270 top
R20  58.67,25.4 270 top
R21  61.21,25.4 270 top
R22  5.33,16.26 0 top
R23  16.51,20.07 90 top
R24  5.33,19.3 0 top
R25  16.51,17.78 90 top
R26  27.43,21.59 270 top
SJ1  22.86,42.8 0 top
SJ2  7.11,46.61 0 top
SJ3  22.86,45.34 0 top
SJ4  50.8,7.62 90 bottom
SJ5  53.34,7.62 90 bottom
SJ6  55.88,7.62 90 bottom
SJ7  58.42,7.62 90 bottom
SJ8  60.96,7.62 90 bottom
SJ9  63.5,7.62 90 bottom
SJ10  68.33,7.62 90 bottom
SJ11  70.87,7.62 90 bottom
SJ12  70.36,27.18 0 bottom
SJ13  70.36,28.7 0 bottom
SJ14  41.02,21.59 90 bottom
SJ15  38.73,21.59 90 bottom
SJ16  63.5,45.72 270 bottom
SJ17  60.96,45.72 270 bottom
SJ18  58.42,45.72 270 bottom
SJ19  55.88,45.72 270 bottom
SJ20  53.34,45.72 270 bottom
SJ21  50.8,45.72 270 bottom
SJ22  48.26,45.72 270 bottom
SJ23  45.72,45.72 270 bottom
SJ24  38.1,45.72 270 bottom
SJ25  35.56,45.72 270 bottom
SJ26  33.02,45.72 270 bottom
SJ27  30.48,45.72 270 bottom
SJ28  27.94,45.72 270 bottom
SJ29  25.4,45.72 270 bottom
SJ30  25.15,33.02 180 bottom
SJ31  25.15,30.48 180 bottom
SJ32  25.15,27.94 180 bottom
SJ33  36.83,42.67 180 bottom
SJ34  36.83,40.39 180 bottom
SJ35  36.83,38.1 180 bottom
SJ36  36.83,35.81 180 bottom
SW1  22.35,3.3 0 top
SW2  7.87,50.04 180 top
U$5  3.94,44.2 0 top
U$14  2.79,5.08 0 top
XTL1  51.56,21.84 270 top
XTL2  15.24,28.45 0 top
XTL3  38.35,10.92 90 top
Z1  9.4,36.58 270 top
Z2  9.4,40.39 90 top

### Tracks (layer width: path | path; a pad name or v marks a point on that pad's centre or on a via)
2_MISO  (via drill 0.5)
  Top 0.254: v23.37,33.02 H13.4 | H6.1 16.26,45.97 14.22,45.97 13.72,45.47 13.72,43.94 14.22,43.43 15.49,43.43 16,42.93 19.3,42.93 19.81,42.42 v19.81,40.89 19.3,40.39 19.01,40.39 IC2.17
  Bottom 0.254: v19.81,40.89 20.07,41.15 23.11,41.15 24.13,40.13 24.13,35.81 24.38,35.56 SJ30.1 v23.37,33.02
2_MOSI  (via drill 0.5)
  Top 0.254: IC2.16 20.29,39.6 v20.83,40.13 20.83,41.15 20.32,41.66 20.32,42.67 19.56,43.43 16.26,43.43 H6.4 | v23.37,30.48 H13.3
  Bottom 0.254: v20.83,40.13 21.34,40.64 22.86,40.64 23.62,39.88 23.62,38.1 21.84,36.32 21.84,30.73 22.1,30.48 v23.37,30.48 SJ31.1
2_PB4  (via drill 0.5)
  Top 0.254: v27.69,35.56 H13.5 | IC2.18 18.27,41.13 v18.67,41.53
  Bottom 0.254: v27.69,35.56 25.4,35.56 24.64,36.32 24.64,40.39 23.37,41.66 20.57,41.66 20.32,41.91 19.05,41.91 v18.67,41.53
2_PB5  (via drill 0.5)
  Top 0.254: v27.69,38.1 H13.6 | IC2.19 17.77,41.67 v17.53,41.91
  Bottom 0.254: v27.69,38.1 25.91,38.1 25.15,38.86 25.15,40.64 23.37,42.42 18.03,42.42 v17.53,41.91
2_PB6  (via drill 0.5)
  Top 0.254: IC2.20 17.27,40.9 16.76,41.4 16.26,41.4 v15.75,41.91 | v27.69,40.64 H13.7
  Bottom 0.254: v15.75,41.91 16.76,42.93 23.62,42.93 25.91,40.64 v27.69,40.64
2_PB7  (via drill 0.5)
  Top 0.254: IC2.21 16.77,40.64 16.51,40.89 15.24,40.89 v14.22,41.91 | v27.69,43.18 H13.8
  Bottom 0.254: v14.22,41.91 15.75,43.43 23.88,43.43 24.13,43.18 v27.69,43.18
2_PD0
  Top 0.254: IC2.6 17.77,34.81 18.29,34.29 18.8,34.29 20.32,32.77 20.32,28.96 22.61,26.67 31.75,26.67 H14.1
2_PD1
  Top 0.254: IC2.7 18.28,35.56 18.29,35.56 18.29,35.05 18.54,34.8 19.05,34.8 20.83,33.02 20.83,29.97 21.59,29.21 31.75,29.21 H14.2
2_PD4  (via drill 0.5)
  Top 0.254: H14.5 31.75,36.83 24.13,36.83 23.37,36.07 20.57,36.07 20.05,36.6 IC2.10
  Route2 0.254: v67.56,32.51 61.47,32.51 59.69,34.29 34.29,34.29 H14.5
  Bottom 0.254: SJ13.1 70.84,31.02 69.34,32.51 v67.56,32.51
2_PD5  (via drill 0.5)
  Top 0.254: 19.33,37.08 IC2.11 20.31,37.1 20.83,36.58 23.11,36.58 25.91,39.37 31.75,39.37 H14.6
  Route2 0.254: H14.6 34.29,36.83 57.91,36.83 61.72,33.02 66.55,33.02 67.06,33.53 68.33,33.53 v69.34,34.54
  Bottom 0.254: SJ12.1 71.37,27.18 71.88,27.69 71.88,30.99 69.34,33.53 v69.34,34.54
2_PD6
  Top 0.254: H14.7 31.75,41.91 27.69,41.91 22.86,37.08 21.08,37.08 20.57,37.6 IC2.12
  Bottom 0.254: SJ33.1 35.05,42.67 H14.7
2_PD7
  Top 0.254: H14.8 31.75,44.45 27.43,44.45 26.42,43.43 26.42,41.4 24.38,39.37 | 24.38,39.37 22.61,37.59 21.34,37.59 20.83,38.1 IC2.13 | 24.38,39.37 22.1,41.66 SJ1.1 22.35,43.05 22.35,43.43 22.61,43.69 22.61,43.94 23.37,44.7 23.37,45.09 SJ3.2 23.62,45.21
2_SCK  (via drill 0.5)
  Top 0.254: IC2.15 19.34,39.12 21.08,39.12 21.59,39.62 v22.61,39.62 22.61,40.13 20.83,41.91 20.83,47.24 19.56,48.51 16.26,48.51 H6.3 | v23.37,27.94 H13.2
  Bottom 0.254: v22.61,39.62 23.11,39.12 23.11,38.35 21.34,36.58 21.34,28.45 21.84,27.94 v23.37,27.94 SJ32.1
2_SS  (via drill 0.5)
  Top 0.254: IC2.14 21.58,38.6 v21.84,38.61
  Route15 0.254: v35.05,38.1 33.78,36.83 23.62,36.83 v21.84,38.61 21.84,27.94 22.86,26.92 28.96,26.92 H13.1
  Bottom 0.254: SJ35.1 SJ36.1 | v35.05,38.1 SJ35.1 | SJ34.1 SJ35.1
3.3V  (via drill 0.5)
  Top 0.254: 3.56,26.42 v3.3,26.16 | 2.31,26.16 v3.3,26.16 | 66.73,15.49 P4.4 | 4.35,26.42 IC4.5 | C7.2 2.06,26.16 v3.3,26.16
  Top 0.406: 3.56,26.42 4.35,26.42 | H1.4 H8.4 | C22.1 v71.37,9.65 | v68.58,15.49 66.73,15.49
  Route2 0.406: v68.58,15.49 71.37,12.7 v71.37,9.65 71.37,5.59 69.6,3.81 36.83,3.81 H8.4
  Bottom 0.508: 26.67,3.81 34.54,3.81
  Bottom 0.61: v3.3,26.16 2.03,26.16 1.52,25.65 1.52,12.45 2.79,11.18 17.78,11.18 22.61,6.35 24.64,6.35 25.65,5.33 25.65,4.32 26.16,3.81 26.67,3.81 | 34.54,3.81 H8.4
5V  (via drill 0.5)
  Top 0.254: IC2.32 14.51,36.1 14.22,35.81 14.22,34.98 v14.4,34.8 | v71.63,33.53 72.14,33.53 72.62,33.05 LED4.A LED3.A LED1.A LED2.A | IC1.5 49.28,18.09 v49.78,18.29 | IC1.17 41.66,18.29 v41.15,18.8 41.37,19.02 C24.1 41.37,20.55 43.18,22.35 L2.2 | IC2.4 16.77,35.05 v18.54,33.27 | R1.2 C4.1 62,30.25 62.23,30.48 62.23,30.99 62.99,31.75 64.86,31.75 H5.2 | v58.42,11.43 58.42,10.41 57.4,9.4 51.36,9.4 50.83,9.93 C25.1 49.3,9.93 IC1.38 | R11.2 v11.68,51.82
  Top 0.305: C10.1 3.97,22.38 4.38,22.79 | C14.1 11.61,32 v14.4,34.8
  Top 0.406: 24.89,10.67 24.64,12.53 24.89,12.28 C5.+
  Top 0.61: IC4.1 4.38,22.79 4.83,22.35 v5.33,22.35 5.84,22.35 6.28,22.79 IC4.3
  Top 0.813: v23.24,11.43 v26.54,11.43 24.89,11.43 C5.+
  pour Route15: 0,50.8 arc-74 2.54,53.34 68.58,53.34 arc-74 71.12,50.8 71.12,40.64 73.66,38.1 73.66,5.08 71.12,2.54 arc-74 68.58,0 2.54,0 arc-74 0,2.54
5V_PSU
  Top 0.305: R23.2 21.15,20.55 L3.2
  Top 0.61: H15.3 24.89,20.07 22.1,20.07 | 22.1,20.07 21.63,20.07 L3.2 | C20.1 26.79,18.93 26.42,19.3 22.86,19.3 22.1,20.07
A0  (via drill 0.5)
  Top 0.254: IC1.37 49.53,9 v49.53,7.62
  Bottom 0.254: v49.53,7.62 50.07,8.1 SJ4.2
A0_H
  Bottom 0.406: H2.1 H9.1 SJ4.1
A1  (via drill 0.5)
  Top 0.254: v48.01,7.37 48.01,9.82 IC1.36
  Bottom 0.254: SJ5.2 52.55,8.89 48.51,8.89 48.01,8.38 v48.01,7.37
A1_H
  Bottom 0.406: H2.2 H9.2 SJ5.1
A2  (via drill 0.5)
  Top 0.254: v46.99,8.13 46.99,10.13 IC1.35
  Bottom 0.254: SJ6.2 54.58,9.4 47.5,9.4 46.99,8.89 v46.99,8.13
A2_H
  Bottom 0.406: H2.3 H9.3 SJ6.1
A3  (via drill 0.5)
  Top 0.254: v45.97,7.37 45.97,10.43 IC1.34
  Bottom 0.254: SJ7.2 56.61,9.91 46.48,9.91 45.97,9.4 v45.97,7.37
A3_H
  Bottom 0.406: H2.4 H9.4 SJ7.1
A4  (via drill 0.5)
  Top 0.254: v44.96,8.13 44.96,10.18 IC1.33
  Bottom 0.254: SJ8.2 58.65,10.41 45.97,10.41 44.96,9.4 v44.96,8.13
A4_H  (via drill 0.5)
  Route2 0.254: v38.73,23.37 39.75,22.35 42.67,22.35 51.05,13.97 51.05,10.67 53.34,8.38 57.66,8.38 H9.5
  Bottom 0.254: SJ15.2 v38.73,23.37
  Bottom 0.406: H2.5 H9.5 SJ8.1
A5  (via drill 0.5)
  Top 0.254: IC1.32 43.69,10.38 43.69,9.65 43.94,9.4 v43.94,7.37
  Bottom 0.254: SJ9.2 58.39,13.21 52.83,13.21 50.55,10.92 45.72,10.92 43.94,9.14 v43.94,7.37
A5_H  (via drill 0.5)
  Route2 0.254: v41.02,23.37 42.42,23.37 51.56,14.22 51.56,10.92 53.59,8.89 59.69,8.89 H9.6
  Bottom 0.254: SJ14.2 v41.02,23.37
  Bottom 0.406: H2.6 H9.6 SJ9.1
A6  (via drill 0.5)
  Top 0.254: v42.93,8.13 42.93,8.64 43.18,8.89 43.18,10.58 IC1.31
  Bottom 0.254: SJ10.2 66.77,9.65 62.74,9.65 58.67,13.72 52.58,13.72 50.29,11.43 45.47,11.43 42.93,8.89 v42.93,8.13
A6_H
  Bottom 0.305: SJ10.1 H10.2
  Bottom 0.406: H2.7 H10.2
A7  (via drill 0.5)
  Top 0.254: v41.4,8.13 42.67,9.4 42.67,10.78 IC1.30
  Bottom 0.254: SJ11.2 69.88,8.1 67.82,10.16 62.99,10.16 58.93,14.22 52.32,14.22 50.04,11.94 45.21,11.94 v41.4,8.13
A7_H
  Bottom 0.305: SJ11.1 H10.1
  Bottom 0.406: H2.8 H10.1
AREF
  Top 0.254: C9.1 H16.1 46.99,6.35 41.4,6.35 40.39,7.37 40.39,8.89 40.89,9.4 41.66,9.4 42.16,9.91 42.16,10.98 IC1.29
  Route2 0.305: H3.8 23.88,45.47 25.65,43.69 25.65,35.81 28.96,32.51 28.96,24.89 30.73,23.11 35.31,23.11 37.59,20.83 40.64,20.83 42.16,19.3 42.16,17.78 36.58,12.19 36.58,7.11 37.34,6.35 46.99,6.35 H16.1
AVCC  (via drill 0.5)
  Top 0.254: C21.1 v38.35,28.7 39.12,27.94 39.12,26.16 39.88,25.4 41.09,25.4 41.12,25.37 L2.1 | C23.1 40.13,10.19 v40.13,11.18 40.95,11.18 IC1.27
  Route2 0.254: v40.13,11.18 40.13,14.48 42.93,17.53
  Route2 0.305: 42.93,17.53 42.93,19.56 40.89,21.59 38.1,21.59 35.81,23.88 35.05,23.88 34.54,24.38 34.54,27.18 36.07,28.7 v38.35,28.7
D0_RX  (via drill 0.5)
  Top 0.254: R5.1 v38.35,33.02 | v53.34,26.67 52.07,26.67 49.78,24.38 49.78,21.43 IC1.9
  Route15 0.254: v38.35,33.02 39.62,34.29 41.4,34.29 41.91,34.8 41.91,43.69 42.67,44.45 63.75,44.45 v64.52,44.7
  Bottom 0.254: v53.34,26.67 55.63,26.67 58.42,29.46 58.42,32.51 62.23,36.32 62.23,43.94 62.74,44.45 63.75,44.45 64.26,44.7 | 64.26,44.7 v64.52,44.7 | SJ16.2 63.5,45.21 64.26,44.7
D0_RX_H
  Bottom 0.305: SJ16.1 H12.1 H4.1
D1_TX  (via drill 0.5)
  Top 0.254: R4.1 v38.35,30.48 | v54.1,27.94 52.58,27.94 49.28,24.64 49.28,21.62 IC1.10
  Route15 0.254: v38.35,30.48 36.83,32 36.83,33.27 37.85,34.29 38.61,34.29 39.37,35.05 39.37,45.72 40.13,46.48 61.21,46.48 v62.23,45.47
  Bottom 0.254: v54.1,27.94 56.13,27.94 57.91,29.72 57.91,32.77 59.69,34.54 59.69,43.94 60.2,44.45 61.21,44.45 61.47,44.7 | 61.47,44.7 v62.23,45.47 | SJ17.2 60.96,45.21 61.47,44.7
D1_TX_H
  Bottom 0.305: SJ17.1 H12.2 H4.2
D2  (via drill 0.5)
  Top 0.254: v59.69,45.47 58.67,44.45 57.66,44.45 57.15,43.94 57.15,42.42 56.64,41.91 55.12,41.91 54.61,41.4 54.61,29.72 53.85,28.96 52.83,28.96 48.77,24.89 48.77,21.82 IC1.11
  Bottom 0.254: SJ18.2 59.46,45.24 v59.69,45.47
D2_H
  Bottom 0.305: SJ18.1 H12.3 H4.3
D3  (via drill 0.5)
  Top 0.254: v57.15,45.47 56.13,44.45 55.12,44.45 54.61,43.94 54.61,42.42 54.1,41.91 52.58,41.91 52.07,41.4 52.07,28.96 48.26,25.15 48.26,22.59 IC1.12
  Bottom 0.254: SJ19.2 56.92,45.24 v57.15,45.47
D3_H
  Bottom 0.305: SJ19.1 H12.4 H4.4
D4  (via drill 0.5)
  Top 0.254: IC1.13 43.69,19.08 43.69,19.81 46.74,22.86 v46.74,24.38 49.53,27.18 49.53,41.4 50.04,41.91 51.56,41.91 52.07,42.42 52.07,43.94 52.58,44.45 53.59,44.45 v54.61,45.47 | R16.2 v59.94,26.92
  Route15 0.254: v59.94,26.92 58.42,25.4 50.29,25.4 49.28,24.38 v46.74,24.38
  Bottom 0.254: SJ20.2 54.38,45.24 v54.61,45.47
D4_H
  Bottom 0.305: SJ20.1 H12.5 H4.5
D5  (via drill 0.5)
  Top 0.254: IC1.14 43.18,18.89 43.18,20.07 45.72,22.61 45.72,26.16 46.99,27.43 46.99,41.4 47.5,41.91 49.02,41.91 49.53,42.42 49.53,43.94 50.04,44.45 51.05,44.45 v52.07,45.47
  Bottom 0.254: SJ21.2 51.84,45.24 v52.07,45.47
D5_H
  Bottom 0.305: SJ21.1 H12.6 H4.6
D6  (via drill 0.5)
  Top 0.254: IC1.15 42.67,18.69 42.67,20.32 45.21,22.86 45.21,26.67 44.45,27.43 44.45,43.94 44.96,44.45 48.51,44.45 v49.53,45.47
  Bottom 0.254: SJ22.2 49.3,45.24 v49.53,45.47
D6_H
  Bottom 0.305: SJ22.1 H12.7 H4.7
D7  (via drill 0.5)
  Top 0.254: v46.99,45.47 42.93,45.47 41.91,44.45 41.91,27.43 42.67,26.67 43.94,26.67 44.7,25.91 44.7,23.11 42.16,20.57 42.16,18.49 IC1.16
  Bottom 0.254: SJ23.2 46.76,45.24 v46.99,45.47
D7_H
  Bottom 0.305: SJ23.1 H12.8 H4.8
D8  (via drill 0.5)
  Top 0.254: IC1.42 49.37,12.7 50.04,12.7 51.56,14.22 57.91,14.22 v59.69,16
  Bottom 0.254: SJ24.2 39.37,43.97 39.37,38.1 | 39.37,38.1 39.37,26.92 39.62,26.67 40.89,26.67 45.47,22.1 54.36,22.1 59.69,16.76 v59.69,16 | SJ35.2 39.37,38.1
D8_H
  Bottom 0.305: SJ24.1 H11.3 H3.1
D9  (via drill 0.5)
  Top 0.254: IC1.43 49.56,13.21 49.78,13.21 51.31,14.73 56.39,14.73 v58.17,16.51
  Route2 0.254: v36.83,44.96 32.26,44.96 31.75,44.45 31.75,32.51 32.51,31.75 49.02,31.75 49.53,31.24 49.53,19.81 51.56,17.78 51.56,15.75 53.09,14.22 55.88,14.22 v58.17,16.51
  Bottom 0.254: SJ25.2 36.55,45.24 v36.83,44.96
D9_H
  Bottom 0.305: SJ25.1 H11.4 H3.2
D10  (via drill 0.5)
  Top 0.254: 49.4,14.1 IC1.44 50.53,15.24 54.61,15.24 v55.12,15.75
  Route15 0.254: v34.8,29.21 34.8,34.29 38.35,37.85 v38.35,40.39
  Bottom 0.254: v55.12,15.75 55.12,19.81 53.85,21.08 44.96,21.08 40.39,25.65 39.37,25.65 35.81,29.21 v34.8,29.21 | SJ26.2 33.02,45.21 34.29,43.94 37.34,43.94 37.59,43.69 SJ33.2 SJ34.2 v38.35,40.39
D10_H
  Bottom 0.305: SJ26.1 H11.5 H3.3
D11_MOSI  (via drill 0.5)
  Top 0.254: IC1.1 49.76,15.75 53.09,15.75 v54.1,16.76 | R17.2 v57.4,26.92 | R9.2 v37.85,25.15
  Route2 0.254: v54.1,16.76 54.1,18.03 57.4,21.34 v57.4,26.92 58.93,25.4 61.72,25.4 62.99,26.67 64.96,26.67 H5.4
  Bottom 0.254: SJ27.2 31.75,43.97 31.75,27.18 32.26,26.67 36.07,26.67 v37.85,25.15 36.83,24.13 36.83,18.03 38.1,16.76 40.89,16.76 44.7,20.57 53.34,20.57 54.1,19.81 v54.1,16.76
D11_MOSI_H
  Bottom 0.305: SJ27.1 H11.6 H3.4
D12_MISO  (via drill 0.5)
  Top 0.254: H5.1 63.8,30.43 64.9,29.34 64.9,24.26 70.1,18.8 70.1,12.7 69.52,12.12 P4.7 66.38,12.19 v64.01,12.19 | v52.83,17.02 52.07,16.26 49.56,16.26 IC1.2 | R8.2 v35.81,25.15
  Route15 0.254: v52.83,17.02 52.83,15.24 54.1,13.97 62.23,13.97 v64.01,12.19
  Bottom 0.254: SJ28.2 29.21,43.97 29.21,24.38 30.23,23.37 35.81,23.37 | v35.81,25.15 35.81,23.37 | v52.83,17.02 48.77,17.02 48.01,17.78 42.67,17.78 41.15,16.26 36.83,16.26 35.81,17.27 35.81,23.37
D12_MISO_H
  Bottom 0.305: SJ28.1 H11.7 H3.5
D13_SCK  (via drill 0.5)
  Top 0.254: v62.23,19.3 55.63,19.3 54.36,18.03 52.58,18.03 51.31,16.76 49.37,16.76 IC1.3 | Q1.1 60.89,34.99 59.44,33.53 v59.44,31.75 R18.2 | v28.7,21.08 27.46,21.08 R26.2
  Bottom 0.254: SJ29.2 25.4,45.21 26.42,44.2 28.19,44.2 28.7,43.69 v28.7,21.08 28.7,16.51 29.46,15.75 41.4,15.75 42.93,17.27 47.75,17.27 50.29,14.73 59.18,14.73 60.2,13.72 64.01,13.72 64.77,14.48 64.77,16.76 v62.23,19.3 64.9,21.97 64.9,26.63 H5.3 63.3,27.89 v59.44,31.75
D13_SCK_H
  Bottom 0.305: H3.6 H11.8 SJ29.1
GND  (via drill 0.5)
  Top 0.254: 16.26,37.85 16.26,35.56 IC2.3 16.26,35.53 16.26,34.29 17.53,33.02 | 16.26,37.85 IC2.EXP | IC1.TGND 45.21,14.48 45.97,13.72 46.23,13.72 IC1.39 49.05,10.89 C25.2 | IC1.TGND IC1.28 41.66,11.18 41.66,10.7 C23.2 | IC1.6 IC1.TGND | IC1.TGND 44.51,14.73 IC1.18 41.46,17.78 40.64,17.78 40.26,18.16 40.26,19.18 40.41,19.33 C24.2 | v16.26,38.73 16.26,37.85 | R10.1 69.09,33.27 | C21.2 36.35,29.44 36.32,29.59 39.12,29.59
  Top 0.305: SJ3.1 22.1,47.24 v21.97,47.62
  Top 0.406: IC4.2 5.33,24.89 5.08,25.15 3.81,25.15 v3.3,24.64 2.96,24.3
  Top 0.61: 69.09,33.27 68.07,33.78
  Top 1.016: v9.65,18.54 v13.21,18.54 | v9.65,17.02 v13.21,17.02
  other vias: 15.24,27.81 19.3,45.97 1.65,49.15 6.35,33.27 43.69,13.21 46.74,16.26 46.74,13.21 43.31,15.88 9.14,17.78 8.64,17.02 8.64,18.54 13.72,17.78 14.22,18.54 14.22,17.02 9.65,30.35 19.56,27.3 10.03,47.12 33.27,12.45 70.23,23.24 69.22,10.29 71.75,35.94 34.29,21.72 56.13,17.53 58.8,21.46 17.78,38.73 17.78,36.96 16.26,36.96 36.96,46.86 39.12,24.64
  pour Bottom: 0,50.8 arc-74 2.54,53.34 68.58,53.34 arc-74 71.12,50.8 71.12,40.64 73.66,38.1 73.66,5.08 71.12,2.54 arc-74 68.58,0 2.54,0 arc-74 0,2.54
  pour Top: 0,50.8 arc-74 2.54,53.34 68.58,53.34 arc-74 71.12,50.8 71.12,40.64 73.66,38.1 73.66,5.08 71.12,2.54 arc-74 68.58,0 2.54,0 arc-74 0,2.54
  pour Route2: 0,50.8 arc-74 2.54,53.34 68.58,53.34 arc-74 71.12,50.8 71.12,40.64 73.66,38.1 73.66,5.08 71.12,2.54 arc-74 68.58,0 2.54,0 arc-74 0,2.54
N$1
  Top 0.254: C8.1 23.78,42.95 SJ1.2
N$2
  Top 0.254: IC2.1 15.27,34.32 13.24,32.29 R13.1
N$3  (via drill 0.5)
  Top 0.406: Z1.2 9.14,35.56 8.14,34.55 4.07,34.55 4.17,34.66 | L1.1 2.29,46.16 1.52,45.39 1.52,41.92 P1.TAB1 | Z2.2 8.98,41.66 4.32,41.66 4.17,41.51 | 1.52,41.52 P1.TAB1 | 1.52,34.67 P1.TAB2 1.79,34.54 | 1.79,41.66 P1.TAB1
  Top 0.813: 4.07,34.55 3.3,34.54 1.79,34.54 | 4.32,41.66 1.79,41.66 | 1.52,41.52 P1.FIX1 v1.52,39.37 v1.52,36.83 P1.FIX2 1.52,34.67 | P1.PIN1 4.17,41.51 | P1.PIN2 4.17,34.66
  Bottom 0.813: v1.52,36.83 v1.52,39.37
N$4
  Top 0.254: LED3.C 71.35,30.23 R7.2
N$5
  Top 0.254: R6.2 C2.2 54.2,22.07 XTL1.2 49.2,19.43 IC1.7
N$6
  Top 0.254: R7.1 67.82,30.99 66.8,32 65.79,32 63.75,34.04 Q1.3
N$7
  Top 0.254: R6.1 C3.2 52.99,25.68 XTL1.1 51.56,22.5 IC1.8
N$8
  Top 1.016: J1.PWR 16.21,8 D1.A
N$9  (via drill 0.5)
  Top 0.254: v27.69,25.4 29.21,23.88 34.04,23.88 34.54,24.38 34.54,27.18 34.8,27.43 35.79,27.43 R8.1
  Bottom 0.254: SJ30.2 27.43,33.02 27.94,32.51 27.94,25.65 v27.69,25.4
N$10  (via drill 1.02)
  Top 0.254: v68.58,43.18 v66.04,43.18
N$11
  Top 0.254: LED1.C 71.35,28.19 R2.2
N$12  (via drill 1.02)
  Top 0.254: v66.04,40.64 v68.58,40.64
N$13
  Top 0.254: LED2.C 71.35,26.16 R3.2
N$14
  Top 0.254: LED4.C 71.35,32.26 R10.2
N$15  (via drill 1.02)
  Top 0.254: v48.26,40.64 v48.26,38.1
N$16
  Top 0.254: R15.2 9.77,37.06 Z1.1
  Top 0.305: 9.31,37.43 8.64,38.1 P1.D+
  Top 0.406: 9.31,37.43 Z1.1
N$17
  Top 0.254: Z2.1 11.12,39.54 R14.2
  Top 0.305: 9.31,39.54 8.52,38.75 P1.D-
  Top 0.406: Z2.1 9.31,39.54
N$18  (via drill 1.02)
  other vias: 48.26,43.18
N$19
  Top 0.254: C1.1 33.25,9.37 33.78,9.91 36.07,9.91 XTL3.2 39.37,13.21 39.88,13.21 40.39,12.7 41.06,12.7 IC1.25
N$20  (via drill 1.02)
  Top 0.254: v45.72,40.64 v45.72,38.1
N$21  (via drill 1.02)
  other vias: 45.72,43.18
N$22
  Top 0.254: C11.1 37.34,8.38 XTL3.1 38.35,10.67 39.88,12.19 41.26,12.19 IC1.26
N$23  (via drill 0.5)
  Top 0.305: C15.2 16.48,14.99 v15.49,14.99 | v8.38,14.99 9.33,14.99 IC3.1
  Bottom 0.305: v15.49,14.99 v8.38,14.99
N$24  (via drill 0.5)
  Top 0.254: v26.16,25.4 28.19,23.37 36.32,23.37 36.83,23.88 36.83,27.18 37.08,27.43 37.82,27.43 R9.1
  Bottom 0.254: SJ31.2 26.92,30.48 27.43,29.97 27.43,26.67 v26.16,25.4
N$25
  Top 0.305: C15.1 20.35,15.97 20.83,15.49
  Top 0.813: IC3.3 12.06,13.59 12.45,13.21 16.76,13.21 19.05,15.49 20.83,15.49 21.55,15.49 L3.1
N$26  (via drill 1.02)
  other vias: 60.96,43.18
N$27  (via drill 1.02)
  other vias: 58.42,43.18
N$28
  Top 0.305: C17.1 5.81,18.32 5.59,18.54 5.08,18.54 4.85,18.77 R24.1
N$29  (via drill 1.02)
  Top 0.254: v43.18,40.64 v43.18,38.1
N$30  (via drill 1.02)
  other vias: 43.18,43.18
N$31
  Top 0.305: R25.2 R23.1 15.72,19.59 14.99,20.32 13.39,20.32 IC3.5
N$32  (via drill 1.02)
  Top 0.254: v50.8,40.64 v50.8,38.1
N$33  (via drill 1.02)
  other vias: 50.8,43.18
N$34
  Top 0.305: C18.1 7.37,16.28 7.37,19.81 7.93,20.38 IC3.8
N$35  (via drill 1.02)
  Top 0.254: v60.96,40.64 v60.96,38.1
N$36  (via drill 0.5)
  Top 0.254: R26.1 27.4,22.1 v26.42,22.1
  Bottom 0.254: v26.42,22.1 24.13,22.1 23.62,22.61 23.62,24.64 25.91,26.92 SJ32.2
N$37
  Top 0.305: R22.2 5.84,16.26 6.6,17.02 6.6,20.07 8.38,21.84 10.41,21.84 10.79,21.46 IC3.7
N$38  (via drill 1.02)
  Top 0.254: v58.42,40.64 v58.42,38.1
N$41  (via drill 1.02)
  other vias: 55.88,43.18
N$42  (via drill 1.02)
  Top 0.254: v66.04,50.8 v68.58,50.8
N$43
  Top 0.305: R24.2 C16.1 7.59,22.61 11.43,22.61 12.06,21.97 IC3.6
N$44  (via drill 1.02)
  Top 0.254: v68.58,48.26 v66.04,48.26
N$45  (via drill 1.02)
  Top 0.254: v63.5,40.64 v63.5,38.1
N$46  (via drill 1.02)
  Top 0.254: v66.04,45.72 v68.58,45.72
N$47  (via drill 1.02)
  other vias: 53.34,43.18
N$48  (via drill 1.02)
  Top 0.254: v68.58,38.1 v66.04,38.1
N$50  (via drill 1.02)
  other vias: 40.64,35.56
N$62  (via drill 1.02)
  Top 0.254: v48.26,33.02 v48.26,30.48
N$63  (via drill 1.02)
  other vias: 48.26,35.56
N$65  (via drill 1.02)
  Top 0.254: v45.72,33.02 v45.72,30.48
N$66  (via drill 1.02)
  other vias: 45.72,35.56
N$71  (via drill 1.02)
  Top 0.254: v40.64,40.64 v40.64,38.1
N$72  (via drill 1.02)
  other vias: 40.64,43.18
N$73  (via drill 1.02)
  other vias: 63.5,43.18
N$74  (via drill 1.02)
  Top 0.254: v43.18,33.02 v43.18,30.48
N$75  (via drill 1.02)
  other vias: 43.18,35.56
N$77  (via drill 1.02)
  Top 0.254: v50.8,33.02 v50.8,30.48
N$78  (via drill 1.02)
  other vias: 50.8,35.56
N$83  (via drill 1.02)
  Top 0.254: v55.88,33.02 v55.88,30.48
N$86  (via drill 1.02)
  other vias: 55.88,35.56
N$88  (via drill 1.02)
  Top 0.254: v55.88,40.64 v55.88,38.1
N$92  (via drill 1.02)
  other vias: 53.34,35.56
N$94  (via drill 1.02)
  Top 0.254: v53.34,40.64 v53.34,38.1
N$95  (via drill 1.02)
  Top 0.254: v53.34,33.02 v53.34,30.48
N$97  (via drill 1.02)
  Top 0.254: v40.64,33.02 v40.64,30.48
N$113
  Top 0.254: IC2.2 15.77,34.02 17.24,32.54 R12.2 17.65,31.59 XTL2.2 16.28,27.08 C12.2
N$114
  Top 0.254: C13.2 14.2,27.08 XTL2.1 14.2,29.82 R13.2 R12.1
N$115  (via drill 0.5)
  Top 0.406: P1.VBUS 5.62,39.4 6.06,39.84
  Top 0.61: v7.62,40.39 v6.6,40.39 6.06,39.84 | 1.65,29.97 F1.1
  Top 0.813: v1.65,30.61 1.65,29.97 v1.65,29.34
  Bottom 0.61: v1.65,29.34 1.52,29.34 1.52,30.48 5.59,34.54 5.59,39.62 6.35,40.39 v6.6,40.39 v7.62,40.39
N$116
  Top 0.61: 6.35,46.61 7.87,46.61
N$117
  Top 0.254: IC2.27 14.71,38.61 14.35,38.61 12.45,40.51 12.45,40.89 9.91,43.43 C6.1
N$118
  Top 0.254: R16.1 R21.2 61.21,24.13 61.98,23.37 64.52,20.86 64.52,18.8 65.69,17.62 P4.2
N$119
  Top 0.254: R17.1 R20.2 58.67,24.13 58.93,23.88 60.71,23.88 64.01,20.57 64.01,17.53 65.02,16.52 P4.3
N$120
  Top 0.254: R18.1 R19.2 58.14,28.7 56.9,28.7 56.39,28.19 56.39,24.13 57.15,23.37 60.45,23.37 63.5,20.32 63.5,17.27 65.02,15.75 65.02,14.73 65.44,14.32 P4.5
N$121
  Top 0.305: P4.CD1 56.04,11.94 H17.1
NC
  Top 0.406: H1.1 H8.1
PB0  (via drill 0.5)
  Top 0.254: IC1.40 48.97,11.68 50.55,11.68 52.07,13.21 61.21,13.21 v62.99,14.99
  Bottom 0.254: H11.1 44.45,46.99 44.45,24.64 45.97,23.11 54.86,23.11 v62.99,14.99
PB1  (via drill 0.5)
  Top 0.254: IC1.41 49.17,12.19 50.29,12.19 51.82,13.72 59.44,13.72 v61.21,15.49
  Bottom 0.254: H11.2 41.91,46.99 41.91,26.42 45.72,22.61 54.61,22.61 61.21,16 v61.21,15.49
RD+  (via drill 0.5)
  Top 0.254: IC2.29 13.36,37.6 v13.28,37.64 | R15.1 12.16,36.1 v12.57,35.69
  Bottom 0.254: v13.28,37.64 13.28,36.4 v12.57,35.69
RD-
  Top 0.254: IC2.30 14.71,37.08 13.97,37.08 13.59,36.7 12.83,36.7 12.19,37.34 12.19,37.62 R14.1
RESET  (via drill 0.5)
  Top 0.254: H1.3 31.5,1.02 21.34,1.02 20.85,1.5 SW1.1 | C8.2 26.13,43.91 28.19,45.97 38.35,45.97 39.37,44.96 39.37,36.83 v38.35,35.81 | v66.04,21.08 63.64,23.48 H5.5 61.28,27.71 R1.1 | v60.96,21.08 59.69,19.81 55.37,19.81 54.1,18.54 52.32,18.54 51.05,17.27 49.17,17.27 IC1.4 | v34.29,17.78 H7.6
  Top 0.406: H1.3 H8.3
  Route15 0.254: H8.3 33.02,8.13 34.29,9.4 v34.29,17.78 34.29,20.07 35.56,21.34 35.56,23.11 34.8,23.88 34.8,25.91 36.32,27.43 36.32,33.78 v38.35,35.81
  Bottom 0.254: H1.3 34.29,1.27 69.34,1.27 69.85,1.78 69.85,3.05 72.39,5.59 72.39,16.26 67.56,21.08 v66.04,21.08 | v38.35,35.81 SJ36.2 | v60.96,21.08 60.96,22.67 H5.5
RESET2
  Top 0.254: IC2.24 14.76,40.36 13.49,40.36 12.95,40.89 12.95,41.15 10.92,43.18 10.92,45.72 H6.5 11.68,48.01 R11.1 9.89,49.56 SW2.1
RXLED  (via drill 0.5)
  Top 0.254: R2.1 v67.82,28.96
  Bottom 0.254: SJ13.2 68.07,28.7 v67.82,28.96
SCL  (via drill 0.5)
  Top 0.254: IC1.19 41.26,17.27 40.39,17.27 39.37,18.29 v39.37,19.3
  Route2 0.254: H3.10 20.07,52.07 22.1,52.07 22.61,51.56 22.61,50.04 23.11,49.53 23.11,44.7 24.38,43.43 24.38,37.59 21.59,34.8 21.59,27.18 23.62,25.15 23.62,20.57 24.38,19.81 38.86,19.81 v39.37,19.3
  Route15 0.254: JP1.3 42.42,24.64 42.42,22.35 v39.37,19.3
  Bottom 0.254: v39.37,19.3 40.13,19.3 40.64,19.81 40.64,20.45 SJ14.1
SDA  (via drill 0.5)
  Top 0.254: IC1.20 41.06,16.76 39.62,16.76 v38.61,17.78
  Route2 0.254: H3.9 21.34,49.02 20.83,48.51 20.83,46.23 23.88,43.18 23.88,37.85 21.08,35.05 21.08,20.07 21.84,19.3 37.08,19.3 v38.61,17.78
  Route15 0.254: v38.61,17.78 39.12,17.27 41.91,17.27 45.21,20.57 45.21,25.15 45.97,25.91 47.75,25.91 48.26,26.42 JP1.4
  Bottom 0.254: SJ15.1 38.35,20.45 38.35,18.29 v38.61,17.78
TCK
  Top 0.254: H7.1 32.33,21.77 33.27,20.83 33.27,19.05 33.53,18.8 37.34,18.8 37.59,18.54 37.59,17.27 38.61,16.26 40.86,16.26 IC1.21
TDI
  Top 0.254: H7.9 31.14,11.79 31.5,11.43 36.07,11.43 38.35,13.72 40.13,13.72 40.64,13.21 40.86,13.21 IC1.24
TDO
  Top 0.254: H7.3 29.94,19.78 28.96,18.8 28.96,14.99 29.21,14.73 40.4,14.73 IC1.23
TMS
  Top 0.254: H7.5 32.26,17.78 33.27,16.76 37.34,16.76 38.35,15.75 40.64,15.75 41.02,15.37 IC1.22
TXLED  (via drill 0.5)
  Top 0.254: v67.82,26.92 R3.1
  Bottom 0.254: SJ12.2 68.07,27.18 v67.82,26.92
UGND  (via drill 0.5)
  Top 0.254: IC2.28 14.1,38.1 11.94,40.26 11.94,40.64 10.16,42.42 9.14,42.42 8.38,43.18
  Top 0.305: 8.38,43.18 v7.62,43.18
  Top 0.406: v6.86,36.58 6.63,36.8 P1.GND | L1.2 4.57,46.61 SJ2.1 6.6,46.23
  Top 0.61: v6.86,36.58 v7.87,36.58 | v7.62,43.18 v6.6,43.18 6.6,46.23
  Bottom 0.61: v7.62,43.18 6.73,43.18 | v6.86,36.58 8.76,36.58 9.53,37.34 9.53,41.15 v7.62,43.18 | v6.6,43.18 v7.62,43.18
USBRXD
  Top 0.254: IC2.9 21.12,34.29 31.75,34.29 H14.4 R5.2
USBTXD
  Top 0.254: IC2.8 19.06,35.55 22.86,31.75 31.75,31.75 H14.3 R4.2
USBVCC
  Top 0.254: IC2.31 14.24,36.6 13.46,35.81 13.46,35.05 12.95,34.54 9.4,34.54 7.28,32.43
  Top 0.305: 7.28,32.43 F1.2
  Top 0.61: H15.1 9.65,23.62 8.64,24.64 8.64,27.69 7.37,28.96 7.37,29.89 F1.2
VIN  (via drill 0.5)
  Top 0.305: R22.1 2.66,16.26 C19.1
  Top 0.61: D1.C 17.95,10.67 v20.57,10.67
  Top 0.813: IC3.2 10.79,12.57 | 10.79,12.57 11.68,11.68 16.93,11.68 D1.C | C19.1 2.54,12.45 3.3,11.68 9.91,11.68 10.79,12.57
  Bottom 0.508: 41.91,6.1 41.91,4.32 42.42,3.81 45.72,3.81
  Bottom 0.61: H1.8 45.72,3.81 H8.8 | v20.57,10.67 22.1,9.14 32.77,9.14 35.31,6.6 41.4,6.6 41.91,6.1

### Text on the board
tPlace: AREF | GND | RESET | 32U2 | SCL | SDA | 1 | PB | 13 | 12 | 11 | 10 | 9 | 8 | 7 | 6 | 5 | 4 | TX1 | 3 | RX1 | 2 | TX | 1 | RX | 0 | GND | UBOOT | ~ | ~ | ~ | ~ | ~ | ~ | ~ | 7 | ICSP-USB | RESET | -EN | 6 | 5 | 4 | Phillip Stevens | RX | Goldilocks | v1.1 | 3 | ICSP | TX | 1 | 2 | 1 | GND | 5V | SCL | SDA | POWER | PB0 | PD0 | USB | DC | JTAG | 7-28V | DC | IO | Power | Analog | REF | RST | 3V3 | 5V | GND | GND | VIN | A | 0 | 1 | 2 | 3 | 4 | 5 | REF | 2.1mm | RESET | 1284P
bPlace: SCL | SDA | PB1 | PB0 | PD6 | D10 | SS | D8 | RST | LINK | SPI | MISO | MOSI | SCK | freetronics | GND | 5V | SCL | SDA | A4 | A5 | SKU: GOLDILOCKS | SDA | SCL | www.freetronics.com/goldilocks | Analog Inputs | 0 | 1 | 2 | 3 | 4 | 5 | 6 | 7 | IO | Power | CC | REF | RST | 3V3 | 5V | GND | GND | VIN | A | ROHS | REF
tNames: H7 | IC1
tDocu: 1 | 1 | 1
204bmp: LEDs | RX | TX